# EAGLE board PCB_KioskMB_r3.4-01 (EAGLE 8.2.2), part 1 of 3
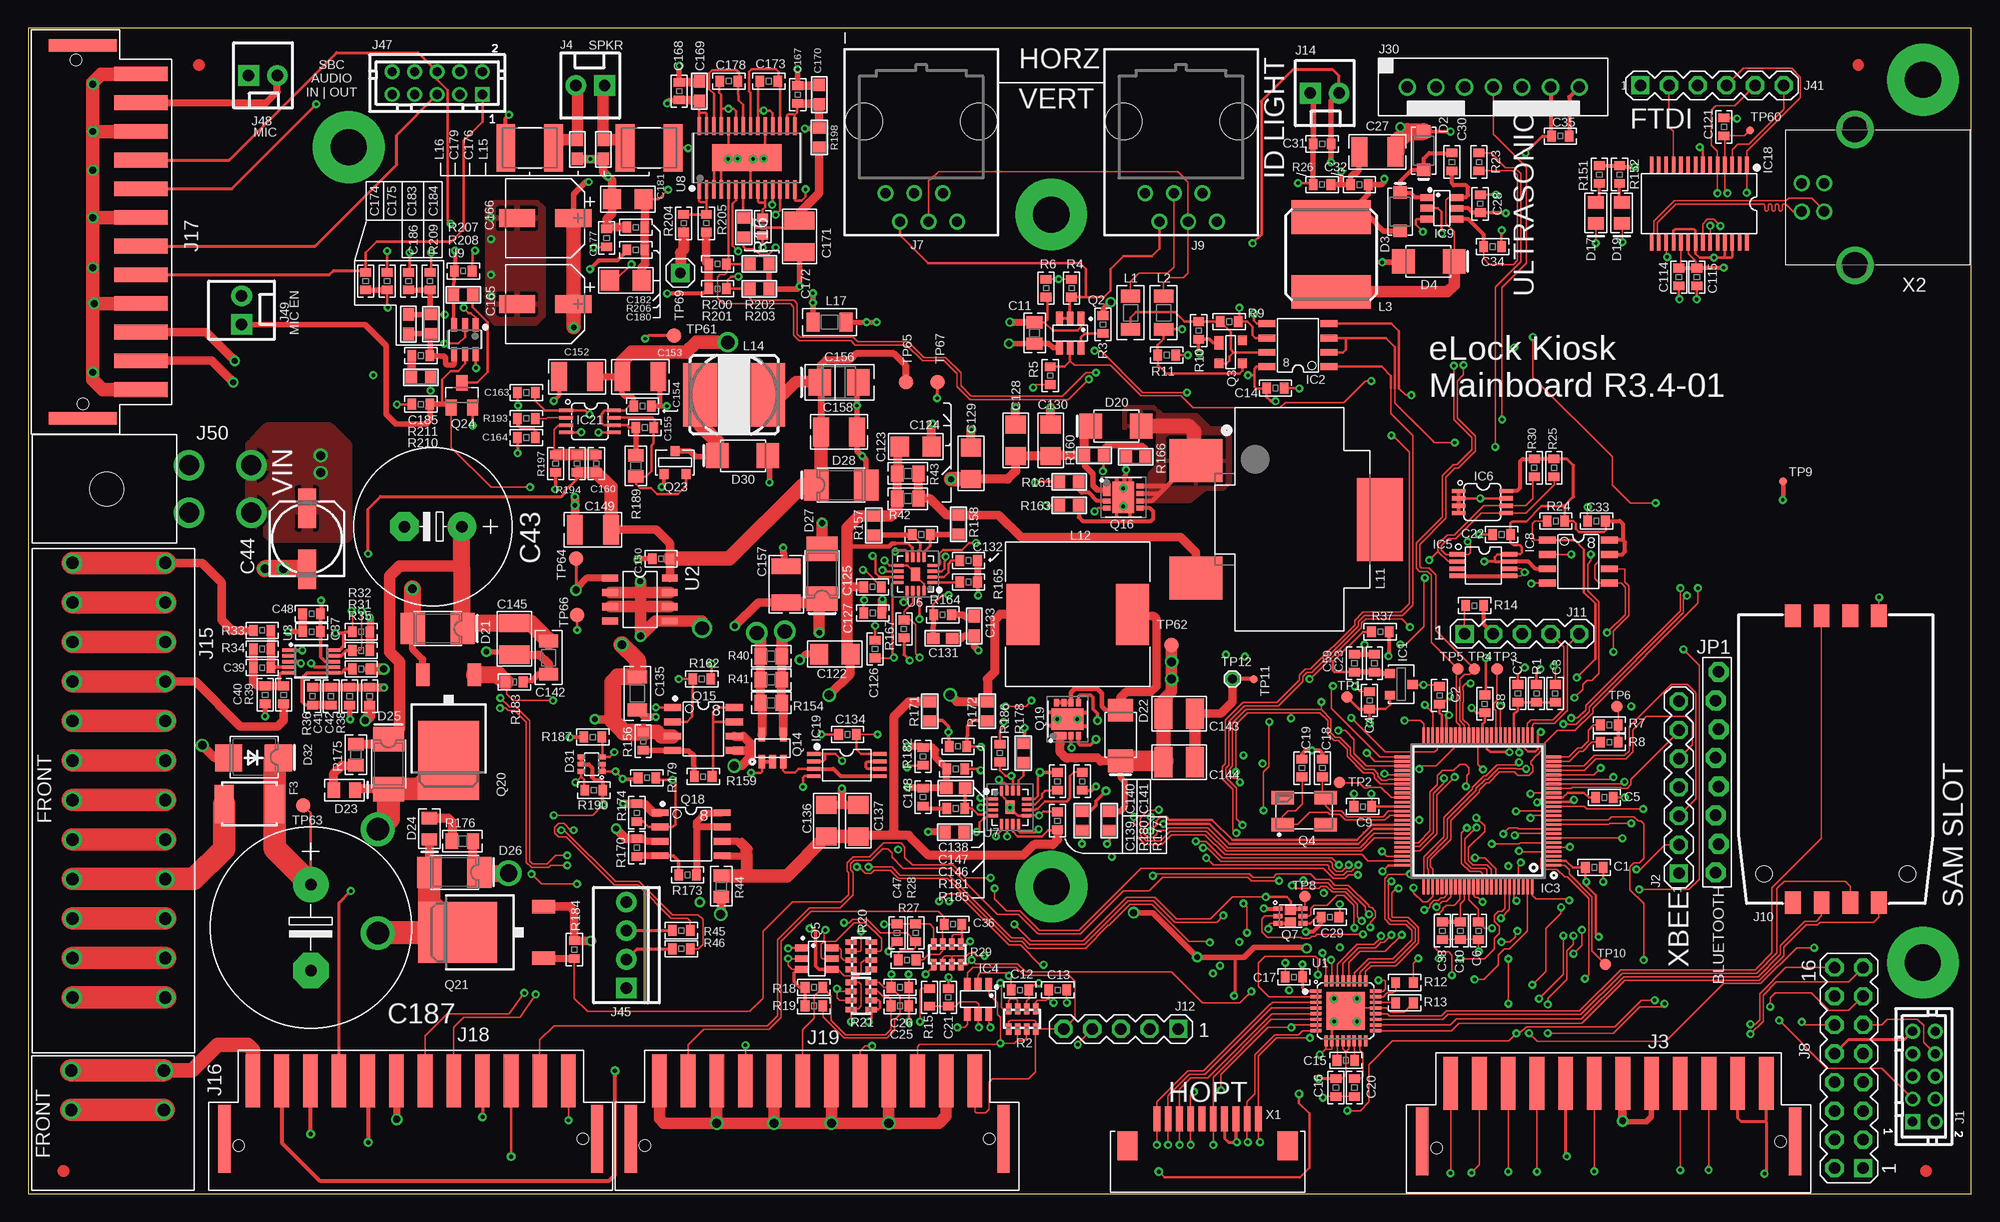
[diagram p11: board, top side]
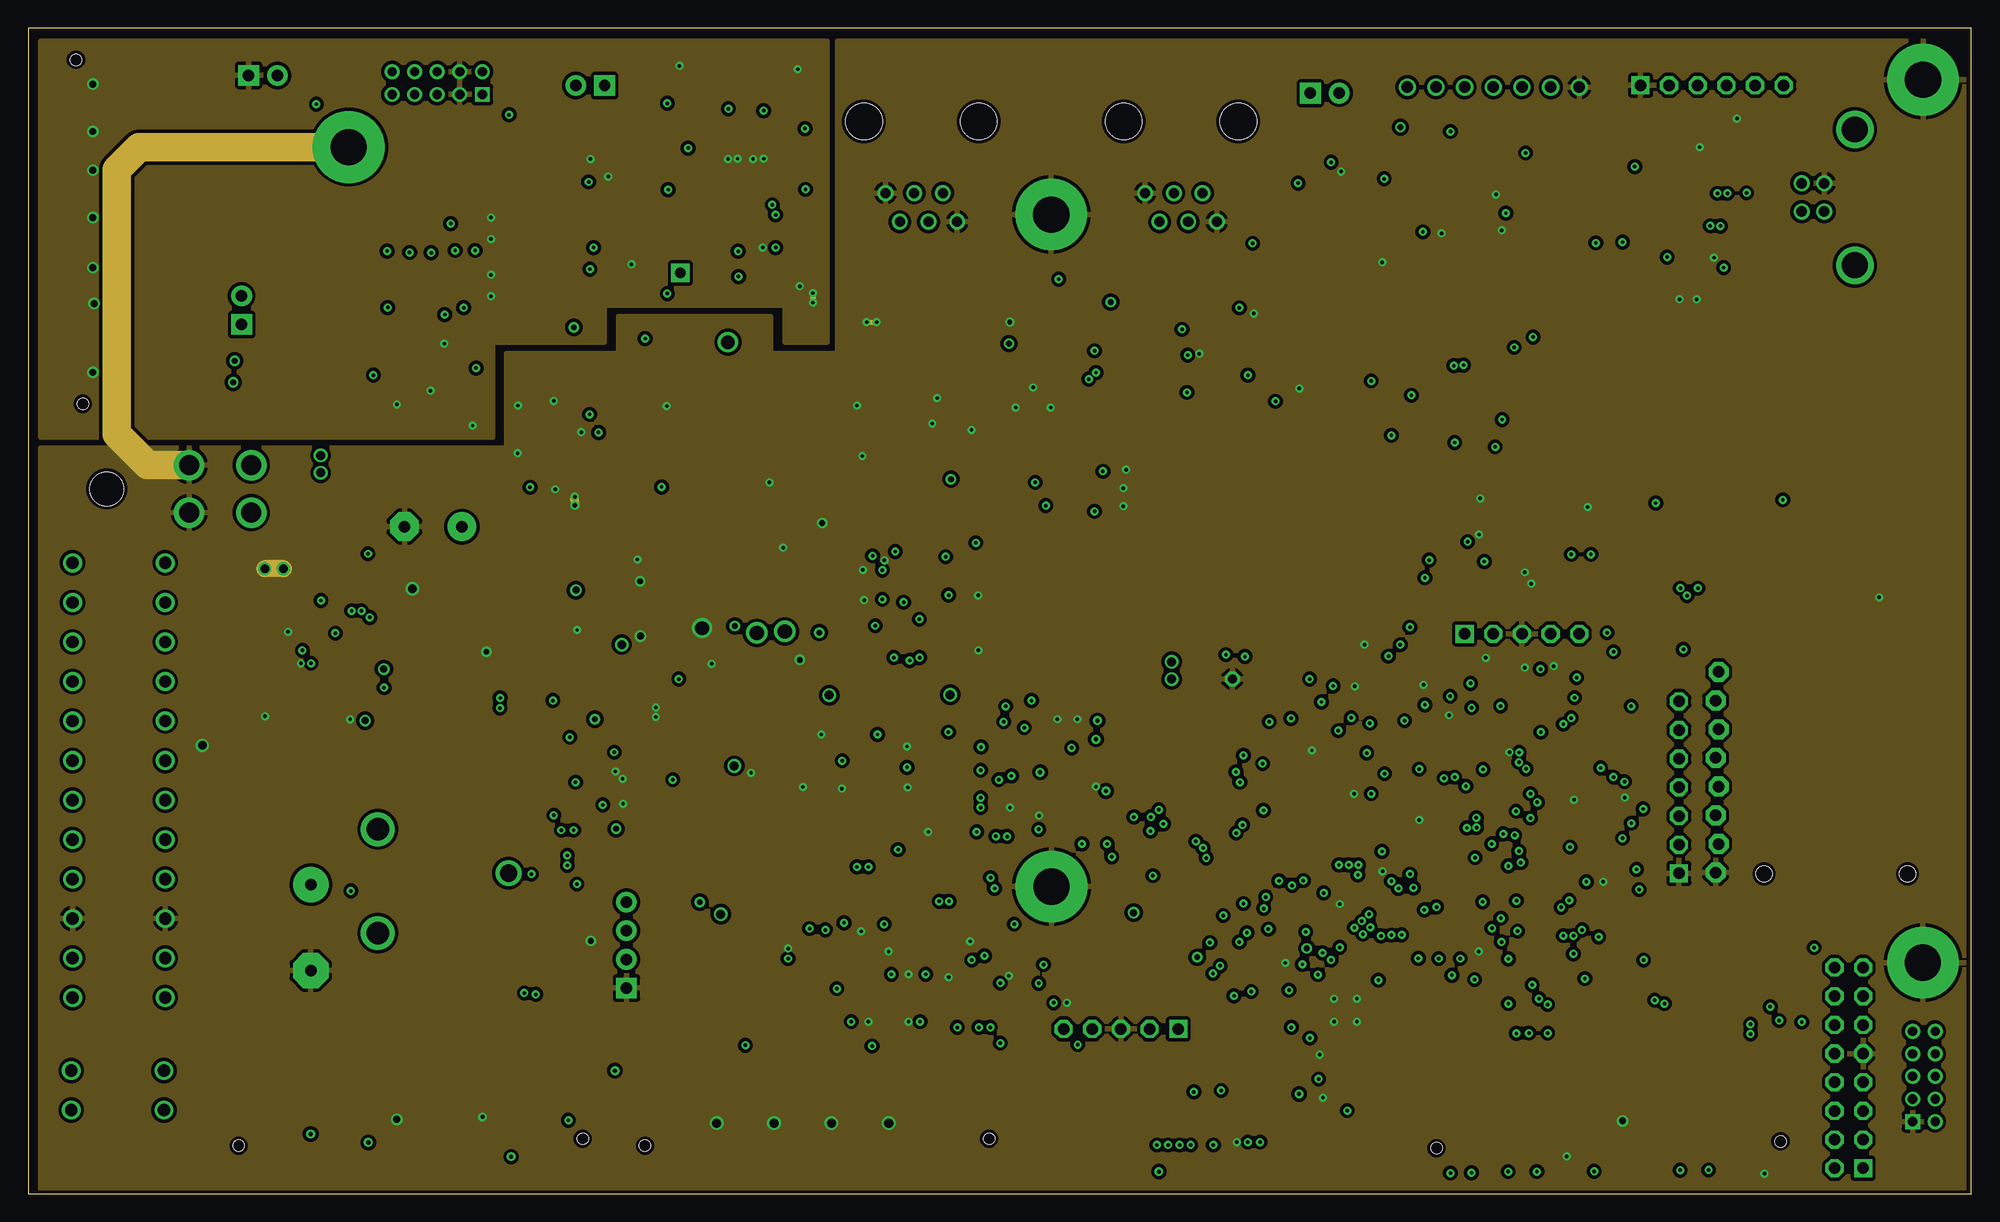
[diagram p12: board, inner layer DGND]
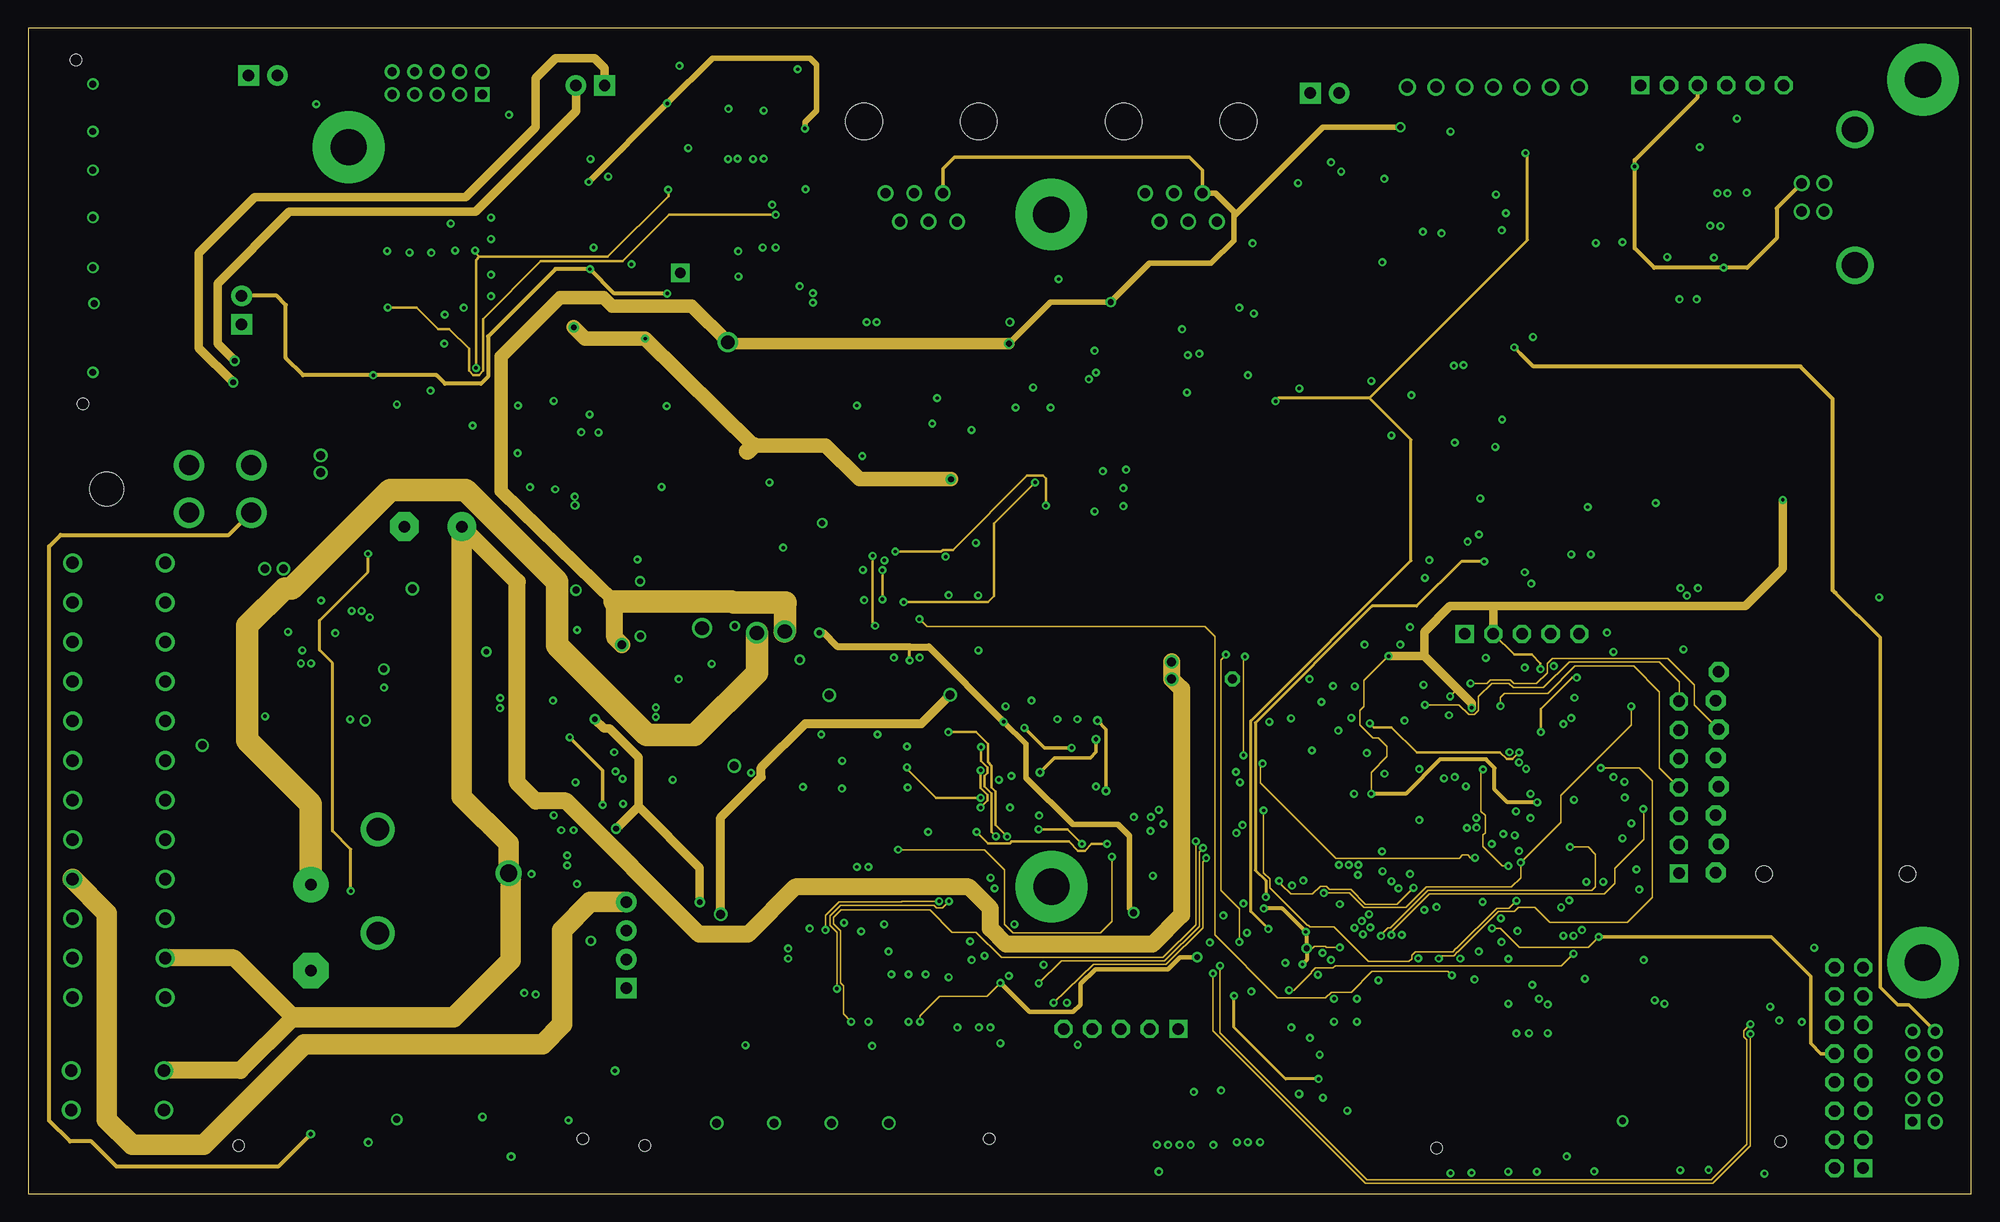
[diagram p13: board, inner layer SUPPLY]
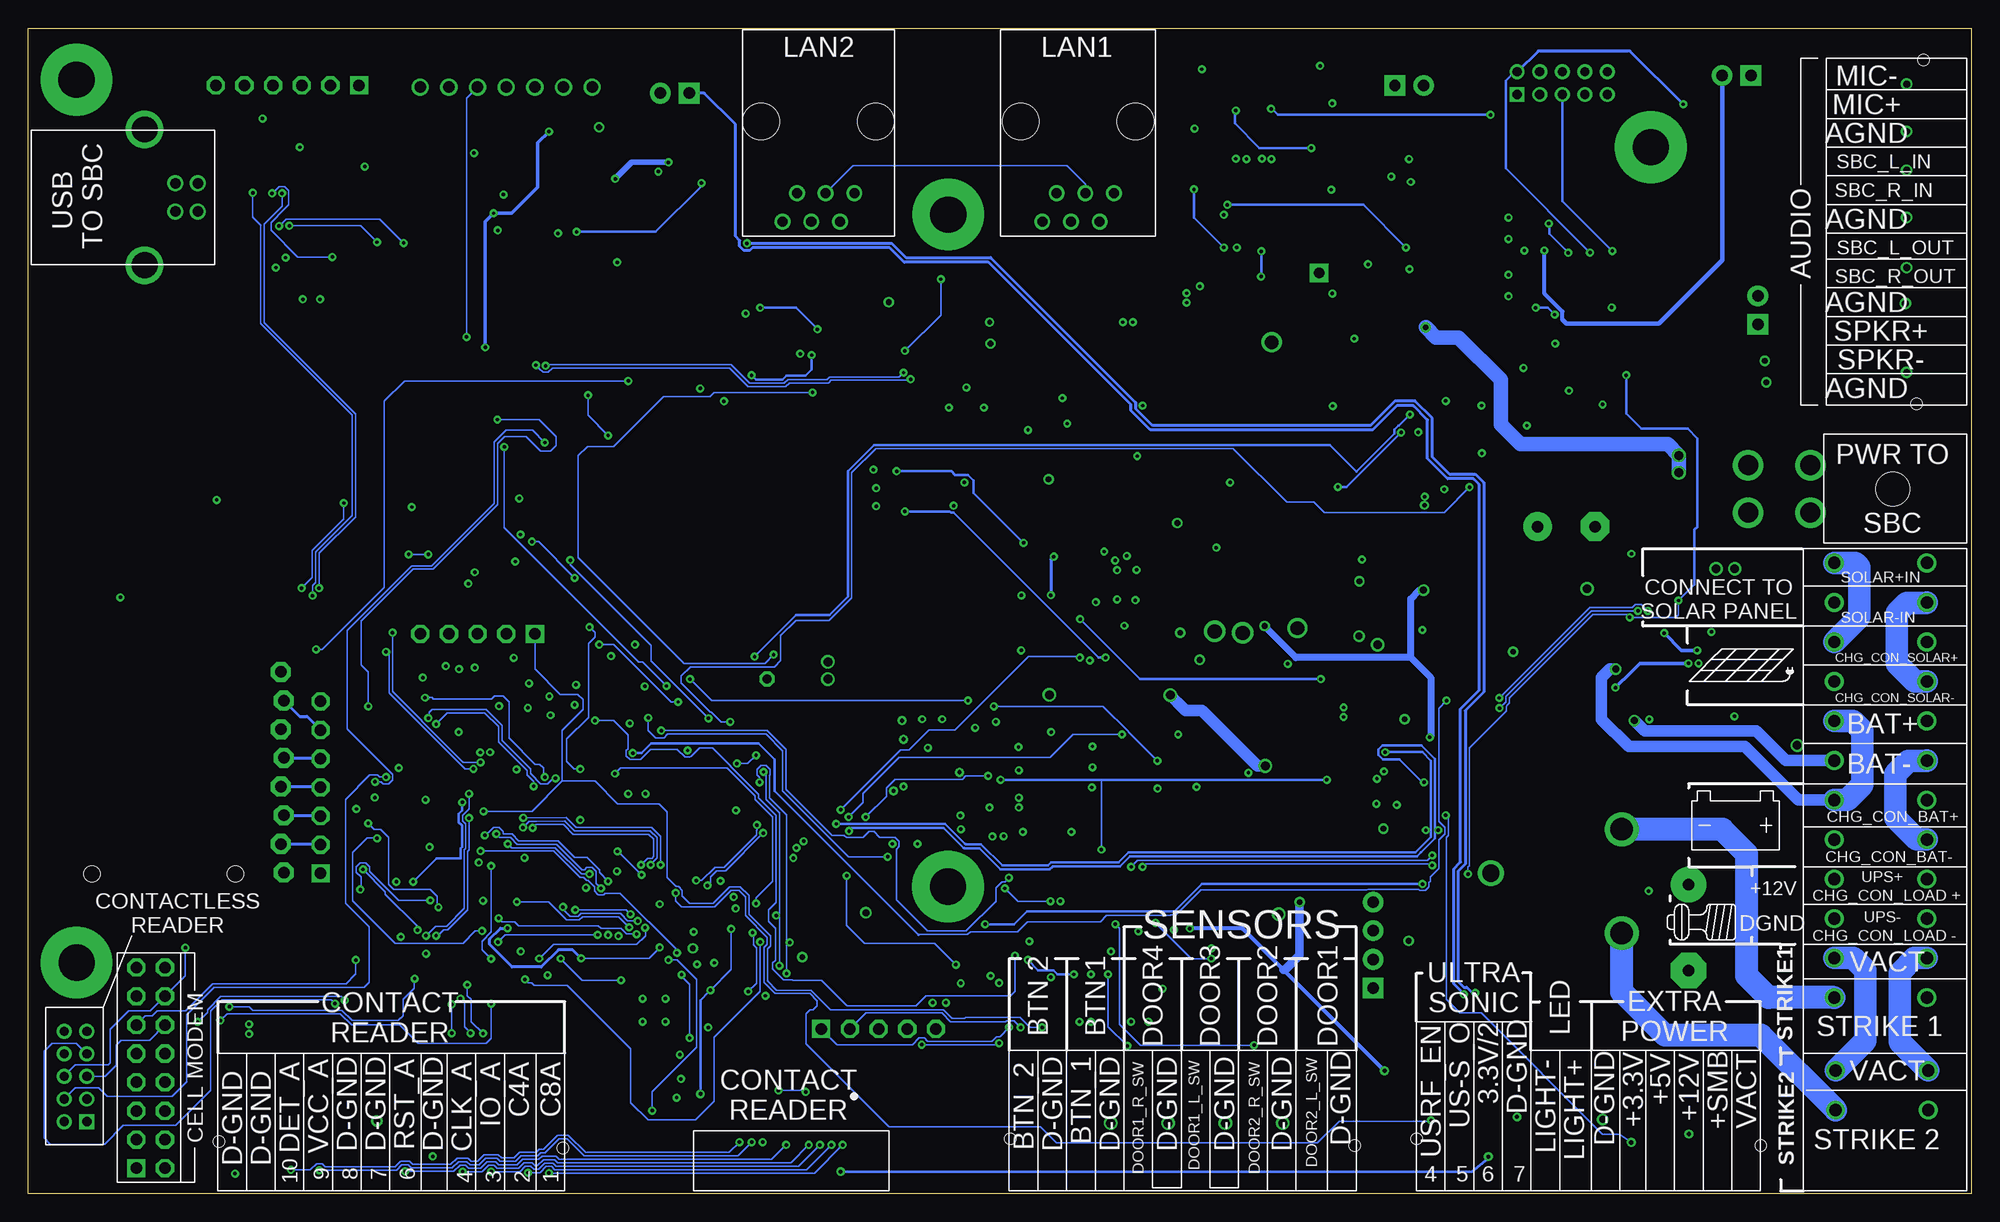
[diagram p14: board, bottom side, seen from below]

Size 172.11 x 103.25 mm. Coordinates in mm from the lower left corner, seen from the top.
Outline: 172.11,103.25 0,103.25 0,0 172.11,0 172.11,103.25
Copper layers (1*2*15*16): Top 0.035mm / dielectric 0.33mm / DGND 0.035mm / dielectric 0.8mm / SUPPLY 0.035mm / dielectric 0.33mm / Bottom 0.035mm
Design rules "alleybeachdrc4layer *": minimum track width 6mil, minimum drill 0.3mm, track to track 6mil, track to pad 6mil, pad to pad 6mil, via to via 6mil, smd to smd 6mil, copper to edge 10mil, drill to drill 10mil, minimum pad ring 10mil, minimum via ring 8mil, stop-mask expansion 4mil, vias tented up to drill 0.3mm, thermal gap 12mil

## Footprints (pad centres in the part's own frame; a part is rotated, then mirrored left to right if it is on the bottom)
0603 = smd 0.762 x 0.965: 1 -0.787,0; 2 0.787,0
0805 = smd 1.092 x 1.397: 1 -0.94,0; 2 0.94,0
1210 = smd 1.397 x 2.591: 1 -1.6,0; 2 1.6,0
E5-13 = drill 1.016 pad 2.54: + -2.54,0 | drill 1.016 pad 2.54 octagon: - 2.54,0
153CLV-0605 = smd 3.5 x 1.6: + 2.7,0; - -2.7,0
C1206 = smd 1.6 x 1.8: 1 -1.4,0; 2 1.4,0
C0603 = smd 1.1 x 1: 1 -0.85,0; 2 0.85,0
1206 = smd 1.143 x 1.702: 1 -1.473,0; 2 1.473,0
C1210 = smd 1.6 x 2.7: 1 -1.4,0; 2 1.4,0
3528-POL = smd 2.007 x 2.388: 1 -1.702,0; 2 1.702,0
CAP_6.3MM_DIA_SMT = smd 1.6 x 3.2: 1 0,2.5; 2 0,-2.5
E7,5-18 = drill 1.016 pad 3.15: + -3.81,0 | drill 1.016 pad 3.15 octagon: - 3.81,0
SOD-123 = smd 1.1 x 1.2: A 1.7,0; C -1.7,0
SOD-128 = smd 2 x 2.2: A 2.2,0; K -2.3,0
0805-POL = smd 1.092 x 1.397: 1+ -0.94,0; 2 0.94,0
SMA = smd 2.159 x 2.743: + -2.311,0.003; - 2.108,-0.002
SMA' = smd 2.159 x 2.743: A 2.108,-0.002; C -2.311,0.003
SOT-363 = smd 0.42 x 0.6: 1 -0.65,-0.95; 2 0,-0.95; 3 0.65,-0.95; 4 0.65,0.95; 5 0,0.95; 6 -0.65,0.95
SMB = smd 2.4 x 2.4: A 2.2,0; C -2.2,0
1812 = smd 1.702 x 3.4: 1 -2.235,0; 2 2.235,0
STANDOFF-ELECTRICAL = drill 3.2 pad 6.35: P1 0,0
SOT-23 = smd 0.787 x 0.889: 1 0.991,1.016; 2 -0.94,1.016; 3 0.025,-1.016
SO08 = smd 0.61 x 1.524: 1 -1.905,-2.743; 2 -0.635,-2.743; 3 0.635,-2.743; 4 1.905,-2.743; 5 1.905,2.743; 6 0.635,2.743; 7 -0.635,2.743; 8 -1.905,2.743
SQFP-S-12X12-100 = smd 0.24 x 1.6: 1 -4.8,-6.6; 2 -4.4,-6.6; 3 -4,-6.6; 4 -3.6,-6.6; 5 -3.2,-6.6; 6 -2.8,-6.6; 7 -2.4,-6.6; 8 -2,-6.6; 9 -1.6,-6.6; 10 -1.2,-6.6; 11 -0.8,-6.6; 12 -0.4,-6.6; 13 0,-6.6; 14 0.4,-6.6; 15 0.8,-6.6; 16 1.2,-6.6; 17 1.6,-6.6; 18 2,-6.6; 19 2.4,-6.6; 20 2.8,-6.6; 21 3.2,-6.6; 22 3.6,-6.6; 23 4,-6.6; 24 4.4,-6.6; 25 4.8,-6.6; 51 4.8,6.6; 52 4.4,6.6; 53 4,6.6; 54 3.6,6.6; 55 3.2,6.6; 56 2.8,6.6; 57 2.4,6.6; 58 2,6.6; 59 1.6,6.6; 60 1.2,6.6; 61 0.8,6.6; 62 0.4,6.6; 63 0,6.6; 64 -0.4,6.6; 65 -0.8,6.6; 66 -1.2,6.6; 67 -1.6,6.6; 68 -2,6.6; 69 -2.4,6.6; 70 -2.8,6.6; 71 -3.2,6.6; 72 -3.6,6.6; 73 -4,6.6; 74 -4.4,6.6; 75 -4.8,6.6 | smd 1.6 x 0.24: 26 6.6,-4.8; 27 6.6,-4.4; 28 6.6,-4; 29 6.6,-3.6; 30 6.6,-3.2; 31 6.6,-2.8; 32 6.6,-2.4; 33 6.6,-2; 34 6.6,-1.6; 35 6.6,-1.2; 36 6.6,-0.8; 37 6.6,-0.4; 38 6.6,0; 39 6.6,0.4; 40 6.6,0.8; 41 6.6,1.2; 42 6.6,1.6; 43 6.6,2; 44 6.6,2.4; 45 6.6,2.8; 46 6.6,3.2; 47 6.6,3.6; 48 6.6,4; 49 6.6,4.4; 50 6.6,4.8; 76 -6.6,4.8; 77 -6.6,4.4; 78 -6.6,4; 79 -6.6,3.6; 80 -6.6,3.2; 81 -6.6,2.8; 82 -6.6,2.4; 83 -6.6,2; 84 -6.6,1.6; 85 -6.6,1.2; 86 -6.6,0.8; 87 -6.6,0.4; 88 -6.6,0; 89 -6.6,-0.4; 90 -6.6,-0.8; 91 -6.6,-1.2; 92 -6.6,-1.6; 93 -6.6,-2; 94 -6.6,-2.4; 95 -6.6,-2.8; 96 -6.6,-3.2; 97 -6.6,-3.6; 98 -6.6,-4; 99 -6.6,-4.4; 100 -6.6,-4.8
SOT23-6 = smd 0.6 x 1.2: 1 -0.95,-1.306; 2 0,-1.306; 3 0.95,-1.306; 4 0.95,1.306; 5 0.003,1.306; 6 -0.95,1.306
TSSOP08-3 = smd 0.38 x 1.4: 1 -0.94,-2.343; 2 -0.305,-2.343; 3 0.33,-2.343; 4 0.965,-2.343; 5 0.965,2.292; 6 0.33,2.292; 7 -0.305,2.292; 8 -0.94,2.292
MSOP-08 = smd 0.38 x 1.2: 1 -1.008,-2.18; 2 -0.358,-2.18; 3 0.292,-2.18; 4 0.942,-2.18; 5 0.942,2.045; 6 0.292,2.045; 7 -0.358,2.045; 8 -1.008,2.045
SO-08 = smd 0.61 x 1.524: 1 -1.905,-2.743; 2 -0.635,-2.743; 3 0.635,-2.743; 4 1.905,-2.743; 5 1.905,2.743; 6 0.635,2.743; 7 -0.635,2.743; 8 -1.905,2.743
SSOP28DB = smd 0.32 x 1.4: 1 -4.225,-3.45; 2 -3.575,-3.45; 3 -2.925,-3.45; 4 -2.275,-3.45; 5 -1.625,-3.45; 6 -0.975,-3.45; 7 -0.325,-3.45; 8 0.325,-3.45; 9 0.975,-3.45; 10 1.625,-3.45; 11 2.275,-3.45; 12 2.925,-3.45; 13 3.575,-3.45; 14 4.225,-3.45; 15 4.225,3.45; 16 3.575,3.45; 17 2.925,3.45; 18 2.275,3.45; 19 1.625,3.45; 20 0.975,3.45; 21 0.325,3.45; 22 -0.325,3.45; 23 -0.975,3.45; 24 -1.625,3.45; 25 -2.275,3.45; 26 -2.925,3.45; 27 -3.575,3.45; 28 -4.225,3.45
TSSOP8 = smd 0.35 x 1.2: 1 -0.975,-2.925; 2 -0.325,-2.925; 3 0.325,-2.925; 4 0.975,-2.925; 5 0.975,2.925; 6 0.325,2.925; 7 -0.325,2.925; 8 -0.975,2.925
MSOP-08' = smd 0.3 x 1.2: 1 -1.008,-2.18; 2 -0.358,-2.18; 3 0.292,-2.18; 4 0.942,-2.18; 5 0.942,2.045; 6 0.292,2.045; 7 -0.358,2.045; 8 -1.008,2.045
DF11-10DP-2DSA = drill 0.813 pad 1.321 square: 1 4,-1 | drill 0.813 pad 1.321: 2 4,1; 3 2,-1; 4 2,1; 5 0,-1; 6 0,1; 7 -2,-1; 8 -2,1; 9 -4,-1; 10 -4,1
MA07-1 = drill 1.016 pad 1.6 square: 1 -7.62,0 | drill 1.016 pad 1.6 octagon: 2 -5.08,0; 3 -2.54,0; 4 0,0; 5 2.54,0; 6 5.08,0; 7 7.62,0
14011213102000 = smd 1.3 x 4.7: 1 13.97,-4.4; 2 11.43,-4.4; 3 8.89,-4.4; 4 6.35,-4.4; 5 3.81,-4.4; 6 1.27,-4.4; 7 -1.27,-4.4; 8 -3.81,-4.4; 9 -6.35,-4.4; 10 -8.89,-4.4; 11 -11.43,-4.4; 12 -13.97,-4.4 | smd 1.1 x 6: P$1 16.51,0.75; P$2 -16.51,0.75 | hole 1: -15.24,0.75; 15.24,1.35
3-641215-2 = drill 1.016 pad 1.829 square: 1 2.54,0 | drill 1.016 pad 1.829: 2 0,0
SS-6566-NF = drill 0.889: 1 -3.175,8.89; 2 -1.905,6.35; 3 -0.635,8.89; 4 0.635,6.35; 5 1.905,8.89; 6 3.175,6.35 | hole 3.251: 5.08,0; -5.08,0
MA08-2 = drill 1.016 pad 1.6 square: 1 -8.89,-1.27 | drill 1.016 pad 1.6 octagon: 2 -8.89,1.27; 3 -6.35,-1.27; 4 -6.35,1.27; 5 -3.81,-1.27; 6 -3.81,1.27; 7 -1.27,-1.27; 8 -1.27,1.27; 9 1.27,-1.27; 10 1.27,1.27; 11 3.81,-1.27; 12 3.81,1.27; 13 6.35,-1.27; 14 6.35,1.27; 15 8.89,-1.27; 16 8.89,1.27
CCM03-3504LFT-NR = smd 2 x 1.4: C1 12.7,3.81; C2 12.7,1.27; C3 12.7,-1.27; C4 12.7,-3.81; C5 -12.7,3.81; C6 -12.7,1.27; C7 -12.7,-1.27; C8 -12.7,-3.81 | hole 1.422: 10.16,6.35; 10.16,-6.35
MA05-1 = drill 1.016 pad 1.6 square: 1 -5.08,0 | drill 1.016 pad 1.6 octagon: 2 -2.54,0; 3 0,0; 4 2.54,0; 5 5.08,0
1990834 = drill 1.1: 1 0,0; 1A 0,8.2; 2 3.5,0; 2A 3.5,8.2; 3 7,0; 3A 7,8.2; 4 10.5,0; 4A 10.5,8.2; 5 14,0; 5A 14,8.2; 6 17.5,0; 6A 17.5,8.2; 7 21,0; 7A 21,8.2; 8 24.5,0; 8A 24.5,8.2; 9 28,0; 9A 28,8.2; 10 31.5,0; 10A 31.5,8.2; 11 35,0; 11A 35,8.2; 12 38.5,0; 12A 38.5,8.2
1990737 = drill 1.1: 1 0,0; 1A 0,8.2; 2 3.5,0; 2A 3.5,8.2
HRXL-MAXSONAR-WRC-MB7387 = drill 1.016: 1 2.54,2.54; 2 5.08,2.54; 3 7.62,2.54; 4 10.16,2.54; 5 12.7,2.54; 6 15.24,2.54; 7 17.78,2.54
MA06-1 = drill 1.016 pad 1.6 square: 1 -6.35,0 | drill 1.016 pad 1.6 octagon: 2 -3.81,0; 3 -1.27,0; 4 1.27,0; 5 3.81,0; 6 6.35,0
3-641215-4 = drill 1.016 pad 1.829 square: 1 3.81,0 | drill 1.016 pad 1.829: 2 1.27,0; 3 -1.27,0; 4 -3.81,0
0039301040 = drill 1.8: 1 -2.1,0; 2 2.1,0; 3 -2.1,5.5; 4 2.1,5.5 | hole 3: 0,-7.3
1X08-LOCK = drill 1.016 pad 1.778 octagon: 1 -8.89,0.127; 2 -6.35,-0.127; 3 -3.81,0.127; 4 -1.27,-0.127; 5 1.27,0.127; 6 3.81,-0.127; 7 6.35,0.127; 8 8.89,-0.127
NRS8030 = smd 7 x 3: 1 0,-3.3; 2 0,3.3
L_SER20XX = smd 3.81 x 4.699: 1 -5.207,-8.319; 2 5.207,-8.319 | smd 7.366 x 4.064: 3 0,8.001
L_SRR1280 = smd 5.4 x 2.9: 1 0,4.85; 2 0,-4.85
CR75 = smd 5.6 x 3: 1 0,-3; 2 0,3
L1812 = smd 1.66 x 4.22: 1 -2.12,0; 2 2.12,0
SSOT-6 = smd 0.6 x 1.2: 1 -0.95,-1.306; 2 0,-1.306; 3 0.95,-1.306; 4 0.95,1.306; 5 0.003,1.306; 6 -0.95,1.306
SOT-143 = smd 1.194 x 0.838: 1 -0.813,-1.041 | smd 0.838 x 0.838: 2 0.991,-1.041; 3 0.991,1.041; 4 -1.016,1.041
7B = smd 2 x 1.2: 1 -1.9,-1.2; 2 1.9,-1.2; 3 1.9,1.2; 4 -1.9,1.2
MICRO_FET = smd 0.42 x 0.8: 1 -0.65,-1.1; 2 0,-1.1; 3 0.65,-1.1; 4 0.65,1.1; 5 0,1.1; 6 -0.65,1.1 | smd 0.8 x 1: P1 -0.5,0; P2 0.5,0
SOT23-5 = smd 0.6 x 1.2: 1 -0.95,-1.206; 2 0,-1.206; 3 0.95,-1.206; 4 0.95,1.206; 5 -0.95,1.206
SON8_3.3X3.3_TI = smd 1.09 x 0.65: 1_2 -0.65,-1.475 | smd 0.44 x 0.65: 3 0.325,-1.475; 4 0.975,-1.475; 5 0.975,1.475; 6 0.325,1.475; 7 -0.325,1.475; 8 -0.975,1.475 | smd 2.8 x 1.9: EP 0,0
TO252 = smd 1.2 x 2: 1 -2.28,-4.8; 2 2.28,-4.8 | smd 5.4 x 7: 3 0,2.8
SOT23 = smd 1 x 1.4: 1 -0.95,-1.1; 2 0.95,-1.1; 3 0,1.1
0603-ARRAY = smd 0.5 x 1: 1 -1.2,-0.9; 2 -0.4,-0.9; 3 0.4,-0.9; 4 1.2,-0.9; 5 1.2,0.9; 6 0.4,0.9; 7 -0.4,0.9; 8 -1.2,0.9
0603-0RTOP = smd 0.762 x 0.965: 1 -0.787,0; 2 0.787,0
R0603 = smd 1 x 1.1: 1 -0.85,0; 2 0.85,0
SMD_ROUND_1MM = smd 1 x 1: P$1 0,0
SMD_ROUND_07MM = smd 0.7 x 0.7: P$1 0,0
TP_0.8_1.2 = drill 0.813 pad 1.219 octagon: 1 0,0
B1,27 = smd 1.27 x 1.27: TP 0,0
P1-13@1 = drill 0.914 pad 1.626 square: 1 0,0
LFCSP_5X5_032 = smd 1 x 0.3: 1 -2.65,1.75; 2 -2.65,1.25; 3 -2.65,0.75; 4 -2.65,0.25; 5 -2.65,-0.25; 6 -2.65,-0.75; 7 -2.65,-1.25; 8 -2.65,-1.75; 17 2.65,-1.75; 18 2.65,-1.25; 19 2.65,-0.75; 20 2.65,-0.25; 21 2.65,0.25; 22 2.65,0.75; 23 2.65,1.25; 24 2.65,1.75 | smd 0.3 x 1: 9 -1.75,-2.65; 10 -1.25,-2.65; 11 -0.75,-2.65; 12 -0.25,-2.65; 13 0.25,-2.65; 14 0.75,-2.65; 15 1.25,-2.65; 16 1.75,-2.65; 25 1.75,2.65; 26 1.25,2.65; 27 0.75,2.65; 28 0.25,2.65; 29 -0.25,2.65; 30 -0.75,2.65; 31 -1.25,2.65; 32 -1.75,2.65 | smd 3.4 x 3.4: PAD 0,0
LE33 = smd 0.635 x 1.4: 1 -1.905,-2.65; 2 -0.635,-2.65; 3 0.635,-2.65; 4 1.905,-2.65; 5 1.905,2.65; 6 0.635,2.65; 7 -0.635,2.65; 8 -1.905,2.65
MSOP10 = smd 0.3 x 1: 1 -1,-2.05; 2 -0.5,-2.05; 3 0,-2.05; 4 0.5,-2.05; 5 1,-2.05; 6 1,2.05; 7 0.5,2.05; 8 0,2.05; 9 -0.5,2.05; 10 -1,2.05
QFN16_3X3_EP = smd 0.85 x 0.28: 1 -1.475,0.75; 2 -1.475,0.25; 3 -1.475,-0.25; 4 -1.475,-0.75; 9 1.475,-0.75; 10 1.475,-0.25; 11 1.475,0.25; 12 1.475,0.75 | smd 0.28 x 0.85: 5 -0.75,-1.475; 6 -0.25,-1.475; 7 0.25,-1.475; 8 0.75,-1.475; 13 0.75,1.475; 14 0.25,1.475; 15 -0.25,1.475; 16 -0.75,1.475 | smd 0.8 x 1.2: EP 0,0
TSSOP28_EP = smd 1.6 x 0.3: 1 -2.8,4.225; 2 -2.8,3.575; 3 -2.8,2.925; 4 -2.8,2.275; 5 -2.8,1.625; 6 -2.8,0.975; 7 -2.8,0.325; 8 -2.8,-0.325; 9 -2.8,-0.975; 10 -2.8,-1.625; 11 -2.8,-2.275; 12 -2.8,-2.925; 13 -2.8,-3.575; 14 -2.8,-4.225; 15 2.8,-4.225; 16 2.8,-3.575; 17 2.8,-2.925; 18 2.8,-2.275; 19 2.8,-1.625; 20 2.8,-0.975; 21 2.8,-0.325; 22 2.8,0.325; 23 2.8,0.975; 24 2.8,1.625; 25 2.8,2.275; 26 2.8,2.925; 27 2.8,3.575; 28 2.8,4.225 | smd 2.4 x 6.17: EP 0,0
SOT23-6' = smd 0.55 x 1.2: 1 -0.95,-1.3; 2 0,-1.3; 3 0.95,-1.3; 4 0.95,1.3; 5 0,1.3; 6 -0.95,1.3
CON-FPC-1.0MM-10POS = smd 0.6 x 2.2: 1 -4.5,0; 2 -3.5,0; 3 -2.5,0; 4 -1.5,0; 5 -0.5,0; 6 0.5,0; 7 1.5,0; 8 2.5,0; 9 3.5,0; 10 4.5,0 | smd 1.8 x 2.6: P$1 -7.1,-2.4; P$2 7.1,-2.4
85-32004-10X = drill 0.92 pad 1.27: 1 4.71,-1.25; 2 4.71,1.25; 3 2.71,1.25; 4 2.71,-1.25 | drill 2.3 pad 3: M1 0,6.02; M2 0,-6.02

## Placement (x,y rotation side)
C1  1u/10V  [0603]  138.71,28.9 0 top
C2  0.1uF  [0603]  125.01,44.15 90 top
C3  10uF/4V  [0603]  135.25,44.32 90 top
C4  0.1uF  [0603]  118.81,43.7 90 top
C5  0.1uF  [0603]  139.61,35.1 0 top
C6  0.1uF  [0603]  128.47,23.3 270 top
C7  10uF/4V  [0603]  131.95,44.32 90 top
C8  1u/10V  [0603]  129.01,43.4 90 top
C9  10uF/4V  [0603]  118.21,34.3 180 top
C10  10uF/4V  [0603]  126.87,23.3 90 top
C11  4.7uF/16V  [0805]  89.14,76.25 90 top
C12  10nF  [0603]  87.85,18.05 180 top
C13  10nF  [0603]  91.19,18.05 0 top
C14  1u/6.3V  [0603]  110.48,71.37 0 top
C15  1u/10V  [0603]  116.71,11.81 0 top
C16  4.7uF/6.3V  [0603]  115.82,9.4 90 top
C17  0.1uF  [0603]  112.11,19.2 180 top
C18  18pF  [0603]  114.63,37.71 270 top
C19  18pF  [0603]  112.83,37.71 270 top
C20  4.7uF/6.3V  [0603]  117.47,9.4 90 top
C21  0.1uF  [0603]  81.5,17.4 90 top
C22  0.1uF  [0603]  130.51,58.4 180 top
C23  10uF/4V  [0603]  119.25,46.99 90 top
C25  10nF  [0603]  77.22,16.64 0 top
C26  10nF  [0603]  77.22,18.29 0 top
C27  22u/16V  [1210]  119.51,92.3 180 top
C28  1uF/16V  [0603]  128.61,87.7 90 top
C29  10uF/4V  [0603]  115.31,24.5 180 top
C30  0.1uF  [0603]  126.11,91.4 270 top
C31  1uF/16V  [0603]  114.61,93 180 top
C32  1uF/16V  [0603]  117.91,89.4 180 top
C33  0.1uF  [0603]  138.91,59.6 180 top
C34  dnp  [0603]  129.71,83.9 0 top
C35  0.1uF  [0603]  135.71,93.7 180 top
C36  10nF  [0603]  81.92,23.88 0 top
C37  0.1uF  [0603]  25.11,49.8 180 top
C38  10uF/4V  [0603]  125.27,23.3 90 top
C39  10uF/4V  [0603]  20.73,46.61 180 top
C40  0.1uF  [0603]  20.98,44.2 270 top
C41  10uF/4V  [0603]  26.82,44.07 90 top
C42  0.1uF  [0603]  28.47,44.07 270 top
C43  470uF/35-50V  [E5-13]  35.86,59.1 180 top
C44  220uF, 16V, AL  [153CLV-0605]  24.69,58.02 90 top
C47  10nF  [0603]  76.96,23.11 270 top
C48  10uF/4V  [0603]  25.1,51.38 180 top
C59  10uF/4V  [0603]  117.47,46.99 90 top
C114  0.1uF  [0603]  146.21,81.21 90 top
C115  4.7uF/6.3V  [0603]  147.81,81.21 90 top
C121  0.1uF  [0603]  150.21,94.51 270 top
C122  22uF,25V,1206  [C1206]  71.44,47.81 180 top
C123  22uF,25V,1206  [C1206]  78.6,66.19 0 top
C124  100pF  [0603]  79.1,58.39 0 top
C125  0.1uF  [0603]  74.79,53.76 0 top
C126  0.1uF  [0603]  75.02,48.25 270 top
C127  4.7uF/6.3V  [0603]  74.81,51.45 180 top
C128  22uF,25V,1206  [C1206]  87.47,66.73 90 top
C129  22uF,25V,1206  [C1206]  83.5,64.7 90 top
C130  22uF,25V,1206  [C1206]  90.57,66.73 90 top
C131  130pF,C0G  [C0603]  81,49.19 0 top
C132  0.1uF  [0603]  83.3,56.09 0 top
C133  15nF  [C0603]  83.8,50.29 270 top
C134  10nF  [0603]  72.56,40.69 180 top
C135  10uF/35V  [1206]  53.96,44.32 270 top
C136  22uF,25V,1206  [C1206]  70.69,33.06 90 top
C137  22uF,25V,1206  [C1206]  73.53,33.03 90 top
C138  100pF  [0603]  82.36,39.64 0 top
C139  0.1uF  [0603]  91.16,33.04 90 top
C140  0.1uF  [0603]  91.16,36.54 90 top
C141  4.7uF/6.3V  [0603]  93.36,36.54 270 top
C142  10uF/35V  [1206]  46.1,47.5 270 top
C143  10uF,50V,1210  [C1210]  101.96,42.54 0 top
C144  10uF,50V,1210  [C1210]  101.96,38.24 0 top
C145  10uF,50V,1210  [C1210]  43.05,49.15 270 top
C146  100pF  [C0603]  82.16,35.94 180 top
C147  0.1uF  [0603]  82.16,37.64 180 top
C148  10nF  [0603]  79.26,35.14 90 top
C149  22u/16V  [1210]  50.02,58.82 180 top
C150  0.1uF  [0603]  56.06,56.25 180 top
C152  22u/16V  [1210]  48.62,72.38 180 top
C153  22u/16V  [1210]  54.22,72.38 0 top
C154  0.1uF  [0603]  54.42,69.78 0 top
C155  1nF  [0603]  54.62,67.88 0 top
C156  TCJB157M006R0045  [3528-POL]  71.82,71.88 0 top
C157  47uF/6.3V  [1210]  67.13,53.98 90 top
C158  47uF/6.3V  [1210]  71.82,67.48 0 top
C160  15pF  [0603]  50.32,64.68 270 top
C163  0.1uF  [0603]  44.12,70.98 180 top
C164  330pF  [0603]  44.12,66.98 180 top
C165  220uF,16V,AL  [CAP_6.3MM_DIA_SMT]  45.79,78.82 270 top
C166  220uF,16V,AL  [CAP_6.3MM_DIA_SMT]  45.79,86.42 270 top
C167  0.1uF  [0603]  68.16,97.37 90 top
C168  0.1uF  [0603]  57.66,97.67 90 top
C169  1.0nF,50V  [C0603]  59.46,97.67 90 top
C170  1.0nF,50V  [C0603]  70.06,97.37 90 top
C171  10uF,50V,1210  [C1210]  68.32,84.8 270 top
C172  1uF,25V  [0603]  65.06,85.67 270 top
C173  0.47uF  [0603]  65.6,98.57 180 top
C174  0.47uF  [0603]  29.89,80.84 270 top
C175  0.47uF  [0603]  31.79,80.84 270 top
C176  1.0nF,50V  [C0603]  50.94,92.52 270 top
C177  0.47uF  [0603]  51.23,84.67 270 top
C178  0.47uF  [0603]  62.06,98.57 180 top
C179  1.0nF,50V  [C0603]  48.64,92.52 270 top
C180  22uF,25V,1206  [C1206]  52.92,80.92 180 top
C181  22uF,25V,1206  [C1206]  53.12,88.12 180 top
C182  1uF,25V  [0603]  53.82,85.62 180 top
C183  3.3uF,16V  [0603]  33.69,80.84 90 top
C184  3.3uF,16V  [0603]  35.59,80.84 90 top
C185  3.3uF,16V  [0603]  34.79,74.24 180 top
C186  220pF  [C0603]  33.69,77.04 90 top
C187  2mF/16V  [E7,5-18]  25.03,23.58 270 top
D2  DNP  [SOD-123]  123.61,92.4 90 top
D3  STPS0540Z  [SOD-123]  121.51,87 270 top
D4  PMEG3030BEP  [SOD-128]  124.01,82.6 180 top
D17  LED-GR  [0805-POL]  138.86,86.89 90 top
D19  LED-GR  [0805-POL]  141.16,86.89 90 top
D20  PMEG3030BEP  [SOD-128]  96.4,68.01 0 top
D21  SMAJ26A  [SMA]  36.17,50.06 180 top
D22  PMEG3030BEP  [SOD-128]  96.76,40.64 90 top
D23  LED-GR  [0805-POL]  28.02,35.76 180 top
D24  LED-GR  [0805-POL]  35.54,32.34 90 top
D25  SS14  [SMA']  31.91,37.95 270 top
D26  SS14  [SMA']  37.64,28.47 180 top
D27  SMLVT3V3  [SMA]  70.32,55.02 90 top
D28  SMAJ5.0A  [SMA]  72.12,62.78 0 top
D30  PMEG3030BEP  [SOD-128]  63.32,65.38 0 top
D31  BAT54BRW-7F  [SOT-363]  49.91,38.05 90 top
D32  P6SMB16A  [SMB]  19.97,38.62 180 top
DRILEGEND  [DRILEGEND]  208.46,100.99 0 top  (outside the outline)
F3  2920L250DR  [1812]  19.59,34.52 0 top
FID1  [REF]  3.11,2 0 top
FID2  [REF]  162.11,100 0 top
FID3  [REF]  15.11,100 0 top
FID4  [REF]  168.11,2 0 top
H1  STANDOFF_ELECTRICAL  [STANDOFF-ELECTRICAL]  28.39,92.72 0 top
H2  STANDOFF_ELECTRICAL  [STANDOFF-ELECTRICAL]  90.64,27.21 0 top
H3  STANDOFF_ELECTRICAL  [STANDOFF-ELECTRICAL]  167.83,20.47 0 top
H4  STANDOFF_ELECTRICAL  [STANDOFF-ELECTRICAL]  167.84,98.69 0 top
H5  STANDOFF_ELECTRICAL  [STANDOFF-ELECTRICAL]  90.61,86.75 0 top
IC1  ISL60002DIH325Z-TK  [SOT-23]  121.61,45.1 90 top
IC2  SN65HVD12D  [SO08]  112.48,75.17 90 top
IC3  PIC24FJ256GA110-I/PT  [SQFP-S-12X12-100]  128.41,33.9 90 top
IC4  PIC10F200T-I/OT  [SOT23-6]  84.14,17.24 180 top
IC5  LM75ADP  [TSSOP08-3]  128.91,55.7 270 top
IC6  24LC32A-I/MS  [MSOP-08]  128.87,61.24 270 top
IC8  M25P16-VMN6P  [SO-08]  137.31,56 270 top
IC9  LM3405AXMK/NOPB  [SOT23-6]  125.21,87.3 270 top
IC18  FT232RL  [SSOP28DB]  148.01,87.71 180 top
IC19  MCP602-I/ST  [TSSOP8]  72.5,37.97 270 top
IC21  LTC1771EMS8  [MSOP-08']  49.82,68.38 270 top
J1  DF11-10DP-2DSA(01)  [DF11-10DP-2DSA]  167.91,10.39 270 top
J2  DNP  [MA07-1]  146.21,36 90 top
J3  14011213102000  [14011213102000]  139.98,5.38 180 top
J4  3-641215-2  [3-641215-2]  48.51,98.17 0 top
J7  SS-6566-NF  [SS-6566-NF]  79.11,95 180 top
J8  TSW-108-07-G-D  [MA08-2]  161.27,11.15 90 top
J9  SS-6566-NF  [SS-6566-NF]  102.11,95 180 top
J10  CCM03-3504LFT-NR  [CCM03-3504LFT-NR]  160.11,38.5 270 top
J11  DNP  [MA05-1]  132.31,49.6 0 top
J12  DNP  [MA05-1]  96.79,14.59 180 top
J14  3-641215-2  [3-641215-2]  116.11,97.5 180 top
J15  1990834  [1990834]  3.94,55.88 270 top
J16  1990737  [1990737]  3.81,10.92 270 top
J17  14011213102000  [14011213102000]  5.59,85.22 90 top
J18  14011213102000  [14011213102000]  33.88,5.61 180 top
J19  14011213102000  [14011213102000]  69.88,5.61 180 top
J30  22-11-2072  [HRXL-MAXSONAR-WRC-MB7387]  119.61,95.5 0 top
J41  DNP  [MA06-1]  149.15,98.19 0 top
J45  3-641215-4  [3-641215-4]  52.99,22.03 270 top
J47  DF11-10DP-2DSA(01)  [DF11-10DP-2DSA]  36.23,98.39 0 top
J48  3-641215-2  [3-641215-2]  22.06,99.08 180 top
J49  3-641215-2  [3-641215-2]  18.9,79.54 270 top
J50  0039301040  [0039301040]  14.25,62.45 270 top
JP1  DNP  [1X08-LOCK]  149.61,37.34 90 top
L1  HI1206T500R-00  [1206]  97.65,78.05 90 top
L2  HI1206T500R-00  [1206]  100.57,78.05 90 top
L3  NRS8030T150MJGJ  [NRS8030]  115.41,83.2 0 top
L11  SER2013-472MLD  [L_SER20XX]  111.73,59.74 270 top
L12  SRR1280-150M  [L_SRR1280]  92.96,51.32 270 top
L14  CR75NP-220KC  [CR75]  62.52,70.78 270 top
L15  HI1812V101R-10  [L1812]  54.99,92.65 0 top
L16  HI1812V101R-10  [L1812]  44.43,92.65 180 top
L17  HI1206T500R-00  [1206]  70.98,77.21 180 top
Q2  FDC6330L  [SSOT-6]  92.3,76.25 180 top
Q3  SR3.3.TCT  [SOT-143]  106.51,74.57 270 top
Q4  7B-28.63636MAAJ-T  [7B]  113.01,33.9 0 top
Q5  FDC6330L  [SSOT-6]  69.85,20.83 270 top
Q7  SSM6P49NU,LFPZ  [MICRO_FET]  111.81,24.6 270 top
Q14  MAX9938HEUK  [SOT23-5]  65.93,39.47 0 top
Q15  SI4564DY  [SO-08]  59.81,41.16 270 top
Q16  CSD87331Q3D  [SON8_3.3X3.3_TI]  97,61.71 270 top
Q18  SI4564DY  [SO-08]  58.71,31.85 270 top
Q19  CSD87331Q3D  [SON8_3.3X3.3_TI]  92.06,42.04 0 top
Q20  IPD30N06S2L-23  [TO252]  37.24,41.17 180 top
Q21  IPD30N06S2L-23  [TO252]  40.85,23.16 90 top
Q23  FDN352AP  [SOT-23]  57.32,64.78 180 top
Q24  BSS138  [SOT23]  38.41,70.75 0 top
R1  300R  [0603]  133.6,44.32 90 top
R2  4x100K  [0603-ARRAY]  88.04,15.48 0 top
R3  1M  [0603]  95.21,77.01 270 top
R4  1M  [0603]  92.42,80.22 270 top
R5  1M  [0603]  90.53,72.47 90 top
R6  1M  [0603]  90.17,80.22 90 top
R7  100K  [0603]  140.05,41.53 0 top
R8  3.57K  [0603]  140.05,40.01 0 top
R9  1M  [0603]  106.38,77.27 180 top
R10  1M  [0603]  103.68,76.47 90 top
R11  1M  [0603]  100.84,74.3 0 top
R12  470K  [0603-0RTOP]  121.91,18.7 0 top
R13  0R  [0603-0RTOP]  121.91,16.9 180 top
R14  33K  [0603]  128.11,52.1 0 top
R15  0R  [0603-0RTOP]  79.85,17.4 90 top
R16  0  [R0603]  63.37,85.6 270 top
R18  649R  [0603]  69.6,18.29 0 top
R19  649R  [0603]  69.6,16.64 0 top
R20  4x100K  [0603-ARRAY]  73.79,21.08 270 top
R21  4x100K  [0603-ARRAY]  73.79,17.53 270 top
R23  10K  [0603]  128.51,91.4 270 top
R24  1M  [0603]  135.31,59.6 180 top
R25  10K  [0603]  135.15,64.31 270 top
R26  0.22R  [0603]  114.6,89.41 0 top
R27  649R  [0603]  77.85,20.7 0 top
R28  649R  [0603]  78.61,23.11 90 top
R29  4x100K  [0603-ARRAY]  81.41,21.21 0 top
R30  10K  [0603]  133.4,64.31 270 top
R31  10K  [0603]  29.49,48.13 0 top
R32  10K  [0603]  29.49,49.78 0 top
R33  10K  [0603]  20.73,49.91 180 top
R34  1K  [0603]  20.73,48.26 0 top
R35  10K  [0603]  29.49,46.48 0 top
R36  1K  [0603]  25.17,44.07 270 top
R37  300R  [0603]  119.76,49.78 0 top
R38  470R  [0603]  30.25,44.07 270 top
R39  470R  [0603]  22.63,44.2 270 top
R40  0.025R  [0805]  65.82,47.6 0 top
R41  0.025R  [0805]  65.82,45.53 0 top
R42  0.025R  [0805]  77.92,61.58 0 top
R43  0.025R  [0805]  77.92,63.8 0 top
R44  0.025R  [0805]  61.39,27.24 270 top
R45  470R  [0603]  57.85,23.31 180 top
R46  470R  [0603]  57.85,21.71 180 top
R151  470R  [0603]  139.16,90.29 90 top
R152  470R  [0603]  140.96,90.29 90 top
R154  0.025R  [0805]  65.81,43.48 0 top
R156  1M  [0603]  54.48,40.09 90 top
R157  10  [R0603]  74.9,59.19 90 top
R158  10  [R0603]  82.4,59.29 90 top
R159  1M  [0603]  59.79,36.96 180 top
R160  178k,1%  [R0603]  94.4,65.41 180 top
R161  0  [R0603]  92.2,63.08 180 top
R162  10K  [0603]  59.67,45.6 180 top
R163  0  [R0603]  92.2,60.98 180 top
R164  5.90K,1%  [0603]  81,51.29 180 top
R165  93.1K,1%  [0603]  83.3,54.19 180 top
R166  20.0k,1%  [R0603]  98.1,65.31 0 top
R167  100K  [0603]  77.56,50.04 270 top
R170  1M  [0603]  53.91,30.66 270 top
R171  10  [R0603]  79.86,42.74 90 top
R172  10  [R0603]  84.96,42.74 90 top
R173  1M  [0603]  58.41,28.25 0 top
R174  1M  [0603]  53.91,33.75 90 top
R175  3.3K  [0805]  29.03,38.89 90 top
R176  3.3K  [0805]  38.47,31.23 0 top
R177  178k,1%  [R0603]  95.76,33.04 90 top
R178  0  [R0603]  88.16,39.04 270 top
R179  10K  [0603]  54.81,36.85 0 top
R180  0  [R0603]  93.36,33.04 270 top
R181  5.90K,1%  [0603]  82.16,34.14 0 top
R182  93.1K,1%  [0603]  79.26,38.74 270 top
R183  1M  [0603]  43.05,45.34 0 top
R184  1M  [0603]  48.37,21.63 90 top
R185  20.0k,1%  [R0603]  82.06,32.04 0 top
R186  100K  [0603]  86.06,39.04 90 top
R187  47K  [0603]  50.01,40.45 180 top
R189  0.12R  [0805]  53.82,64.48 90 top
R190  47K  [0603]  50.11,35.75 0 top
R193  10K  [0603]  44.12,68.68 0 top
R194  3.09M  [0603]  48.62,64.68 90 top
R197  1M  [0603]  46.72,64.68 270 top
R198  10  [R0603]  70.06,93.57 90 top
R200  1M  [0603]  61.06,82.37 0 top
R201  1M  [0603]  61.06,80.17 0 top
R202  DNP  [R0603]  64.76,82.37 0 top
R203  DNP  [R0603]  64.76,80.17 0 top
R204  1K  [0603]  58.06,85.97 270 top
R205  100K  [0603]  60.06,85.97 270 top
R206  33R  [0603]  53.82,83.62 180 top
R207  3.3K  [0603]  38.53,81.74 180 top
R208  6.8k  [R0603]  38.53,79.64 0 top
R209  120k  [R0603]  35.69,77.04 270 top
R210  1M  [0603]  34.79,69.94 180 top
R211  3.9k  [R0603]  34.79,72.34 0 top
TP1  [SMD_ROUND_1MM]  116.81,44 0 top
TP2  [SMD_ROUND_1MM]  116.16,36.42 0 top
TP3  [SMD_ROUND_1MM]  130.11,46.5 0 top
TP4  [SMD_ROUND_1MM]  128.11,46.48 0 top
TP5  [SMD_ROUND_1MM]  126.65,46.48 0 top
TP6  [SMD_ROUND_1MM]  140.72,43.18 0 top
TP8  [SMD_ROUND_1MM]  113.1,26.33 180 top
TP9  [SMD_ROUND_07MM]  155.44,63.09 90 top
TP10  [SMD_ROUND_1MM]  139.7,20.32 0 top
TP11  [SMD_ROUND_07MM]  108.56,45.6 90 top
TP12  TP_0812  [TP_0.8_1.2]  106.66,45.6 0 top
TP60  [SMD_ROUND_07MM]  152.51,94.21 270 top
TP61  TPB1,27  [B1,27]  57.19,76.01 0 top
TP62  TPB1,27  [B1,27]  101.28,48.59 0 top
TP63  TPB1,27  [B1,27]  24.33,34.41 0 top
TP64  TPB1,27  [B1,27]  48.51,56.26 0 top
TP65  TPB1,27  [B1,27]  77.74,71.91 0 top
TP66  TPB1,27  [B1,27]  48.62,51.28 0 top
TP67  TPB1,27  [B1,27]  80.54,71.91 0 top
TP69  [P1-13@1]  57.76,81.57 0 top
U1  LTC1955  [LFCSP_5X5_032]  116.71,16.2 0 top
U2  LE33CD  [LE33]  54.19,52.64 270 top
U3  ADS1015IDGS  [MSOP10]  25.06,47.15 270 top
U6  TPS43061  [QFN16_3X3_EP]  78.6,54.89 180 top
U7  TPS43061  [QFN16_3X3_EP]  86.96,34.24 0 top
U8  TPA3111D1PWP  [TSSOP28_EP]  63.66,91.77 90 top
U9  OPA322SAIDBVT  [SOT23-6']  38.69,75.68 180 top
X1  FH12-22(10)SA-1SH  [CON-FPC-1.0MM-10POS]  104.47,6.64 0 top
X2  MINI-USB_4P-85-32004-10X  [85-32004-10X]  161.8,88.27 180 top

## Tracks (layer width: path | path; a pad name or v marks a point on that pad's centre or on a via)
3V3_AUD  (via drill 0.3)
  Top 0.203: U9.6 39.64,73.18 v39.67,73.15 | C181.1 55.85,88.12 v56.69,88.95 | R207.1 39.38,83.36 v39.59,83.57
  Top 0.762: C180.1 54.32,82.06 54.63,82.37 54.63,83.58 R206.1 C182.1 54.67,87.97 C181.1
  SUPPLY 0.203: v39.67,73.15 39.67,82.73 39.95,83.01 | 39.95,83.01 51.33,83.01 56.71,88.39 56.71,88.92 v56.69,88.95 | v39.59,83.57 39.59,83.36 39.95,83.01
5V_ON  (via drill 0.3)
  Top 0.152: IC3.92 130.01,28.78 129.02,29.77 v128.16,29.77
  Top 0.203: C163.1 44.91,70.25 45.77,69.39 IC21.1 49.37,69.39 v49.73,69.04
  SUPPLY 0.152: v128.16,29.77 127.76,29.77 127.54,30 127.06,30 126.78,29.72 115.84,29.72 109.16,36.4 109.16,37.92 v109.34,38.1 | v107.64,38.84 107.64,47.45 v107.78,47.59
  Bottom 0.152: v109.34,38.1 108.37,38.1 v107.64,38.84
  Bottom 0.203: v49.73,69.04 50.72,68.04 50.77,68.04 51.12,67.69 51.12,67.33 54.46,63.99 56.81,66.34 97.17,66.34 99.51,64.01 99.51,52.91 101.14,51.28 104.08,51.28 v107.78,47.59
18V_GND
  Top 0.305: U3.5 22.42,46.15 22.25,45.97 22.25,45.11 22.12,44.98
  Top 0.762: R39.1 22.12,44.98 C40.1 20.32,44.98 19.94,45.36 C39.2 R34.1
18V_SENSE
  Top 0.762: R33.2 18.06,49.91 17.14,50.83 17.14,54.13 15.39,55.88 J15.1A
  Top 2: J15.3A J15.3 | J15.1A J15.1
  Bottom 2: J15.3A 9.91,51.11 9.91,55.5 10.29,55.88 J15.1A
+3.3V  (via drill 0.3, 0.38, 0.51, 0.61)
  Top 0.152: IC3.86 127.61,26.02 128.47,25.17 C6.1 129.03,23.52 v129.66,23.52 | C9.1 119,35.4 v118.97,35.43 | R12.2 122.7,20.42 v123.13,20.85 | v86.11,18.67 86.23,18.54 86.23,16.51 86.36,16.38 R2.8 86.84,17.07 87.02,17.25 87.5,17.25 87.64,17.11 R2.7 | R15.2 79.15,18.19 78.99,18.03 v78.99,15.24 | C16.2 116.36,10.19 116.71,10.54 116.71,12.57 | U1.12 116.46,12.83 116.71,12.57 | v46.56,33.53 49.98,33.53 v50.89,34.44 | 116.71,12.57 116.96,12.82 U1.13
  Top 0.203: R186.2 86.06,40.98 86.4,41.33 v86.4,41.81 | C5.1 138.22,35.1 137.81,35.51 136.37,35.51 135.96,35.1 IC3.16 134.1,35.1 v133.67,34.67 | C1.1 137.93,27.73 v138.02,27.64 138.02,27.26 138.85,26.43 138.85,23.01 v139.11,22.76 | C8.1 128.3,42.61 v127.86,43.05 | C2.1 125.25,43.36 v125.95,44.07 | R1.2 133.6,46.13 v133.95,46.48
  Top 0.229: IC3.2 136.2,29.5 136.8,28.9 C1.1 | IC3.62 C9.1 | IC3.46 125.21,42.39 125.01,42.59 C2.1 | IC3.37 128.81,41.6 129.01,41.8 C8.1 | Q7.4 113.56,23.95 114.11,24.5 C29.2
  Top 0.254: R167.2 77.56,47.75 v78.07,47.24 | TP64.TP 48.54,56.26 48.54,53.82 v48.51,53.47 | J1.9 166.16,13.64 161.23,13.64 J8.10 | C16.2 114.33,10.19 v114.3,10.16 | v106.81,17.53 106.93,17.78 106.93,20.95
  Top 0.279: U1.1 113.14,17.95 112.9,18.19 C17.1
  Top 0.305: R190.2 v50.89,34.44
  Top 0.356: R14.2 128.9,50.47 J11.2 | D31.4 D31.5 49.65,38.05 49.93,37.77 49.93,36.91 50.18,36.65 50.74,36.65 50.89,36.5 R190.2 | v47.97,40.44 47.99,40.45 R187.2 | C17.1 112.87,19.23 v112.87,20.32 | v109.44,25.27 109.46,25.25 Q7.1 | C29.2 114.53,23.92 113.8,23.2 v113.16,23.2 | R37.2 120.55,47.68 v120.49,47.62 | J18.5 30.12,9.96 v30.12,4.55
  Top 0.406: TP9.P$1 155.44,61.49 v155.41,61.47
  Top 0.508: v113.25,21.74 113.23,21.82 108.55,21.82 107.69,20.95 106.93,20.95 v103.55,20.95 99.61,24.89 v97.92,24.89
  Top 0.61: U2.1 49.47,54.55 48.51,53.59 v48.51,53.47
  Top 0.762: v62.59,50.29 64.68,52.38 C157.1
  Top 1.016: 69.99,52.38 C157.1 | 69.99,52.38 D27.+ | v70.07,49.71 70.07,52.3 69.99,52.38
  SUPPLY 0.152: v118.97,35.43 118.97,37.34 120.36,38.73 120.36,39.62 119.6,40.39 119.09,40.39 117.95,41.53 117.95,42.8 118.33,43.18 118.33,45.47 v120.49,47.62 | v129.66,23.52 130.4,23.52 132.07,21.84 138.19,21.84 v139.11,22.76 139.11,22.67 | v113.25,21.74 113.76,21.74 113.93,21.92 114.89,21.92 114.99,21.82 v116.17,21.82 | v78.99,15.24 78.99,15.75 80.72,17.48 84.91,17.48 v86.11,18.67
  SUPPLY 0.203: v125.95,44.07 126.59,44.7 | v133.95,46.48 133.95,46.99 133.19,47.75 131.62,47.75 J11.2
  SUPPLY 0.254: v78.07,47.24 78.07,48.44 | v114.3,10.16 111.38,10.16 106.81,14.73 v106.81,17.53
  SUPPLY 0.305: v50.89,34.44 50.89,37.52 v47.97,40.44 | v139.11,22.76 154.38,22.76 157.89,19.25 157.89,13.31 158.78,12.41 J8.10
  SUPPLY 0.356: v112.87,20.32 113.25,20.7 v113.25,21.74 113.25,23.11 v113.16,23.2 111.09,25.27 v109.44,25.27 | v133.67,34.67 131.03,34.67 129.89,35.81 129.89,37.72 129.13,38.48 125.06,38.48 122.01,35.43 v118.97,35.43
  SUPPLY 0.406: v86.11,18.67 88.67,16.1 92.56,16.1 93.19,16.74 93.19,18.59 94.53,19.89 100.97,19.89 102.03,20.95 v103.55,20.95
  SUPPLY 0.508: v86.4,41.81 88.38,39.83 88.38,36.85 92.53,32.72 96.54,32.72 97.54,31.72 97.54,25.27 v97.92,24.89
  SUPPLY 0.61: v86.4,41.81 79.77,48.44 78.07,48.44 71.7,48.44 70.43,49.71 v70.07,49.71
  SUPPLY 0.762: v127.86,43.05 127.86,43.43 126.59,44.7 123.67,47.62 | v120.49,47.62 123.67,47.62 | 123.67,47.62 123.67,49.78 125.95,52.07 129.76,52.07 | 129.76,52.07 152.11,52.07 155.41,55.37 v155.41,61.47 | J11.2 129.77,52.06 129.76,52.07
  Bottom 0.152: v123.13,20.85 117.11,20.85 116.27,21.69 116.27,21.72 v116.17,21.82 | v30.12,4.55 31.17,5.28 32.69,5.28 43.41,16 45.29,16 46.51,17.22 46.51,31.56 46.33,31.74 46.33,33.28 v46.56,33.53
  Bottom 0.203: v133.67,34.67 133.67,33.95 133.97,33.65 133.97,32.9 133.7,32.62 133.7,30.72 133.82,30.59 133.82,29.72 135.93,29.72 v138.02,27.64
  Bottom 0.254: v123.13,20.85 123.89,21.61 125.15,21.61 126.67,20.09 129.26,20.09 131.24,22.07 131.24,22.55 130.28,23.52 v129.66,23.52
  Bottom 0.61: 49.66,47.5 47.88,45.72 47.88,40.53 v47.97,40.44 | 49.66,47.5 49.66,52.7 48.89,53.47 v48.51,53.47 | v62.59,50.29 62.59,50.24 59.84,47.5 49.66,47.5
+3.3V/1  (via drill 0.3)
  Top 0.152: Q7.6 113.1,25.43 TP8.P$1 | v87.34,23.88 88.82,22.4 93.44,22.4 97.28,26.24 99.81,26.24 101.72,24.33 104.73,24.33 106.69,26.29 v109.62,26.29 | v44.58,28.32 45.47,27.43 v48.61,27.43
  Top 0.203: C33.1 139.74,59.56 139.74,58.8 139.56,58.62 137.36,58.62 137.1,58.88 137.1,59.38 136.89,59.6 R24.1 136.1,60.89 136.06,60.94 134.05,60.94 132.68,59.56 131.46,59.56 131.3,59.4 C22.1 131.3,57.69 131.54,57.45 132.12,57.45 132.33,57.25 132.33,56.82 132.17,56.67 131.23,56.67 IC5.8 130.15,56.64 129.92,56.41 129.92,56.01 | Q7.P1 111.85,25.14 111.85,25.91 111.47,26.29 v109.62,26.29
  Top 0.254: IC5.7 129.92,56.01 v128.98,56.01 v128.97,56.01 | 136.06,60.94 136.87,61.75 136.87,64.52 136.3,65.08 135.17,65.08 R25.1
  Top 0.305: U3.8 26.29,47.15 25.9,47.53 C37.1 25.93,49.83
  Top 0.356: Q7.6 111.96,25.25 Q7.P1 | IC8.7 141.18,56.63 141.44,56.9 141.44,57.72 141.25,57.91 | 141.25,57.91 IC8.8 | C33.1 140.96,59.6 141.25,59.31 141.25,57.91 | IC8.3 133.51,55.37 132.88,56.01 IC5.7 | IC6.8 131.87,62.25 132.15,62.53 132.15,64.87 132.36,65.08 133.39,65.08 R30.1 R25.1 | R206.2 52.97,83.48 52.16,82.68 50.51,82.68 v49.75,81.92 | R201.1 59.8,79.76 v56.61,79.76 | v25.93,52.55 25.93,51.44 C48.1 25.9,51.37 C37.1
  Top 0.61: 30.35,49.91 30.28,49.84 R32.2 30.28,51.03 v30.25,51.05
  Top 0.762: R201.1 R200.1 60.06,82.52 R205.2 | R32.2 R31.2
  SUPPLY 0.254: v128.97,56.01 126.94,56.01 122.98,52.05 119.03,52.05 108.7,41.72 108.7,28.65 109.62,27.74 v109.62,26.29
  SUPPLY 0.356: J49.2 22.02,79.54 22.83,78.74 22.83,74.04 24.35,72.52 v30.57,72.52 36.16,72.52 36.92,71.75 40.1,71.75 40.73,72.39 40.73,75.95 46.7,81.92 v49.75,81.92 51.91,79.76 v56.61,79.76
  Bottom 0.152: v25.93,52.55 25.93,51.28 26.16,51.05 v30.25,51.05 30.53,51.33 33.53,51.33 40.92,43.94 40.92,43.46 41.12,43.26 41.2,43.18 41.2,42.79 44.47,39.51 44.47,29.06 44.58,28.96 v44.58,28.32
  Bottom 0.203: v87.34,23.88 84.8,23.88 83.66,25.02 70.58,25.02 68.17,27.43 v48.61,27.43 | v25.93,52.55 24.51,53.98 24.51,58.83 24.26,59.08 24.26,66.9 25.12,67.77 29.23,67.77 30.57,69.11 v30.57,72.52
+3.3V/2  (via drill 0.3, 0.35)
  Top 0.152: Q7.3 110.05,23.95 109.85,23.75 v109.85,23.44 | J2.2 144.98,30.92 142.79,28.73 v142.46,28.73 | v136.87,21.26 137.63,22.02 v137.63,23.37
  Top 0.203: IC2.8 108.79,73.27 108.6,73.08 108.6,72.52 | 108.6,72.52 108.6,71.5 108.75,71.35 109.67,71.35 C14.1 109.69,70.59 | R11.2 102.7,74.3 v102.71,74.3 | v108.04,72.52 108.6,72.52 | v112.57,8.84 112.57,8.03 113.49,7.11 113.49,2.31 112.62,1.45 100.66,1.45 v100.15,1.96 | v42.77,3.28 J18.10
  Top 0.254: v110.48,70.21 110.08,70.21 109.69,70.59 | C35.2 134.13,93.7 v132.63,92.2
  Top 0.305: Q7.3 111.66,23.95 Q7.P2
  Top 0.356: C35.2 134.93,97.97 J30.6
  SUPPLY 0.152: v136.87,21.26 135.81,20.19 115.8,20.19 115.59,19.99 114,19.99 113.66,19.65 113.66,19.59 112.11,18.03 v111.68,18.03
  SUPPLY 0.254: v109.85,23.44 108.3,24.99 108.3,41.88 122.5,56.08 122.5,66.8 118.81,70.48 | 118.81,70.48 110.76,70.48 v110.48,70.21 | 118.81,70.48 132.81,84.48 132.81,92.1 132.71,92.2 v132.63,92.2
  Bottom 0.152: v109.85,23.44 109.85,19.86 v111.68,18.03 111.84,17.86 | v142.46,28.73 140.48,26.75 140.48,26.52 137.63,23.67 v137.63,23.37
  Bottom 0.203: v102.71,74.3 102.71,73.03 103.27,72.47 104.95,72.47 105.28,72.14 107.66,72.14 v108.04,72.52 | 111.84,17.86 112.56,17.14 v112.56,8.85 v112.57,8.84 | v100.15,1.96 44.22,1.96 42.77,3.15 v42.77,3.28
  Bottom 0.254: JP1.2 146.28,30.99 J2.2
+5V  (via drill 0.3)
  Top 0.254: J18.4 27.53,25.78 v28.57,26.82 | v30.1,56.69 30.1,60.66 31.22,61.77 47.24,61.77 47.52,62.05 47.52,62.23 48.62,63.33 R194.1
  Top 0.61: C158.1 70.22,71.78 C156.1 70.15,71.91 70.15,73.41 70.6,73.86 72.79,73.86 73.35,74.42 76.67,74.42 77.74,73.36 TP65.TP
  Top 0.762: C149.1 55.61,58.82 56.85,57.58 C150.1 U2.8
  Top 1.016: C156.1 70.07,71.93 68.01,71.93 66.86,70.78 L14.2 | R194.1 C160.2
  Top 1.2: 68.63,62.78 D28.+ 69.98,62.95 69.98,63.37 70.22,63.62 C158.1 | C160.2 51.62,62.59 C149.1
  Top 1.27: 68.63,62.78 62.09,56.25 C150.1
  SUPPLY 0.254: v28.57,26.82 28.57,30.5 26.95,32.13 26.95,47.02 25.81,48.16 25.81,50.8 30.1,55.09 v30.1,56.69
+SMB  (via drill 0.3, 0.38, 0.51, 0.76, 1.2, 1.27)
  Top 0.152: R20.6 74.02,20.68 73.79,20.45 73.79,19.56 73.53,19.3 72.26,19.3 71.75,19.81 71.22,19.81 Q5.4
  Top 0.203: C154.1 53.24,69.78 52.85,69.39 IC21.8 51.07,69.39 50.77,69.09 50.77,68.33 51,68.09 IC21.6 53.03,68.09 53.24,67.88 C155.1
  Top 0.305: Q5.4 70.04,19.88 69.72,20.19 69.72,23.24 69.47,23.5 v69.22,23.5 | v130.89,86.87 130.84,86.91 C28.1 | v125.98,94.11 D2.A
  Top 0.356: C28.1 127.94,86.91 127.55,87.3 IC9.5 | J18.2 22.45,4.52 25.81,1.17 51.46,1.17 51.97,1.68 v51.97,10.9
  Top 0.457: C154.1 53.64,70.46 53.48,70.61 52.88,70.61 52.62,70.86 C153.1
  Top 0.508: C155.1 R189.2 | Q2.4 90.76,74.94 90.39,75.31 C11.1 v86.87,75.31 | 55.94,31.19 Q18.3 | v95.89,78.99 95.21,78.32 R3.1 | v121.54,94.49 121.93,94.1 122.17,94.1
  Top 0.61: C152.1 C153.1 | v50.19,42.04 50.32,41.91 | Q18.3 54.74,31.21 54.48,31.47 53.93,31.47 R170.1
  Top 0.762: R170.1 52.96,31.45 v52.07,32.33 | 51.77,41.91 51.64,42.04 v50.19,42.04
  Top 0.8: Q14.4 66.88,43.34 R154.2 R41.2 R40.2
  Top 1.016: R40.2 66.76,49.8 v67,49.81
  Top 1.2: C153.1 52.62,73.7 53.47,74.55 58.29,74.55 59.18,75.44 v61.98,75.44
  Top 1.27: Q15.3 56.12,40.53 55.75,40.89 54.53,40.89 R156.2
  Top 1.5: v52.58,48.64 53.95,47.26 C135.1 52.24,45.79 51.77,45.31 51.77,41.91 52.78,40.89 54.53,40.89
  Top 1.524: D2.A 122.17,94.1 121.16,93.09 121.16,92.34 C27.1
  SUPPLY 0.305: J1.10 166.59,16.71 165.58,16.71 164.03,18.26 164.03,49.28 160.07,53.24 | 132.21,74.4 v131.62,74.98 | J9.2 104.02,90.67 102.87,91.82 82.04,91.82 81.02,90.8 J7.2
  SUPPLY 0.356: 160.07,53.24 159.84,53.47 159.84,70.41 156.97,73.28 133.32,73.28 132.21,74.4
  SUPPLY 0.508: v86.87,75.31 90.55,78.99 v95.89,78.99 99.31,82.42 104.78,82.42 106.81,84.45 106.81,86.61 | 106.81,86.61 106.81,87 105.15,88.65 J9.2 | 106.81,86.61 114.68,94.49 v121.54,94.49
  SUPPLY 0.762: v52.07,32.33 54.05,34.31 | v50.19,42.04 51.03,41.2 51.51,41.2 54.05,38.66 54.05,34.31 | 54.05,34.31 59.49,28.88 v59.49,25.83
  SUPPLY 1.016: v61.98,75.44 62.1,75.31 v86.87,75.31
  SUPPLY 1.2: v61.98,75.44 58.76,78.65 51.7,78.65 50.98,79.38 47.12,79.38 41.91,74.17 41.91,62.23 51.94,52.45
  SUPPLY 1.5: v52.58,48.64 51.94,49.28 51.94,52.45
  SUPPLY 2: v67,49.81 67.06,49.86 67.06,52.15 67.08,52.38 62.48,52.38 62.31,52.45 51.94,52.45
  Bottom 0.305: v131.62,74.98 131.62,86.13 v130.89,86.87 129.29,86.87 127,89.15 127,93.09 v125.98,94.11
  Bottom 0.356: v51.97,10.9 60.91,19.84 64.57,23.5 v69.22,23.5
  Bottom 0.762: v59.49,25.83 59.51,25.81 59.51,21.11 60.78,19.84 60.91,19.84
+SMB_PRE
  Top 2: J15.9 J15.9A 14.67,27.88 17.35,30.56 F3.1
  SUPPLY 1.8: J45.4 49.79,25.84 47.3,23.34 47.3,14.99 45.54,13.23 24.46,13.23 15.54,4.32 9.2,4.32 6.96,6.55 6.96,24.86 J15.9
/3.3V1_ON  (via drill 0.3)
  Top 0.152: IC3.95 131.21,25.18 v130.45,24.41 | Q7.2 109.53,24.6 109.26,24.33 109.26,23.19 109.75,22.71 112.74,22.71 112.84,22.61 113.5,22.61 113.69,22.8 113.97,22.8 114.16,22.99 v118.23,22.99
  Bottom 0.152: v130.45,24.41 130.14,24.1 129.04,24.1 128.68,23.75 121.63,23.75 121.38,23.5 121,23.5 121,23.49 119.59,23.49 119.11,23.02 118.26,23.02 v118.23,22.99
/3.3V2_ON  (via drill 0.3)
  Top 0.152: IC3.94 130.81,25.28 130.52,24.99 130.21,24.99 129.86,24.64 129.86,24.13 129.88,24.1 129.9,24.1 130.3,23.7 130.3,23.05 129.87,22.61 129.87,21.69 129,20.83 v126.84,20.83 | Q7.5 113.47,24.6 113.63,24.77 113.63,25.27 113.89,25.53 115.03,25.53 115.92,26.42 116.55,26.42 117.44,25.53 117.44,23.6 v117.47,23.57
  Bottom 0.152: v126.84,20.83 125.57,22.1 118.2,22.1 117.44,22.86 117.44,23.55 v117.47,23.57
/CL_CS1
  Top 0.152: IC3.1 136.09,29.1 136.49,28.7 136.49,28.32 138.52,26.29 138.52,21.5 TP10.P$1
/CL_CS2  (via drill 0.3)
  Top 0.152: IC3.17 133.13,35.5 v133.06,35.43 | v134.59,16.76 134.59,17.29 136.29,18.99 136.29,21.5 136.87,22.08 v136.87,22.86 | v134.59,14.22 140.41,14.22 142.75,16.56 144.65,16.56 v144.93,16.84
  Bottom 0.152: v133.06,35.43 133.06,34.1 133.64,33.52 133.64,33.03 133.37,32.76 133.37,30.58 133.5,30.45 133.5,25.27 135.07,23.7 136.04,23.7 v136.87,22.86 | v134.59,16.76 v134.59,14.22 | v144.93,16.84 145.26,17.17 154.94,17.17 155.93,16.18 155.93,9.17 159.03,6.07 163.68,6.07 165.35,4.39 170.16,4.39 170.71,4.95 170.71,12.6 169.98,13.34 167.86,13.34 J1.7
/CTS
  Top 0.152: IC18.11 145.73,94.11 145.34,94.5 J41.2
/FMEM1_CS  (via drill 0.3)
  Top 0.152: R24.2 133.46,59.6 133.24,59.38 133.24,58.12 133.45,57.91 IC8.1
  Top 0.203: IC3.28 132.41,39.61 132.83,39.19 133.52,39.19 133.72,39.4 133.72,40.63 v133.99,40.89 | IC8.1 136.98,57.91 137.81,57.07 137.81,53.26 138.8,52.27 138.8,47.36 v137.16,45.72
  SUPPLY 0.203: v133.99,40.89 133.99,42.93 136.78,45.72 v137.16,45.72
/MCLR  (via drill 0.3)
  Top 0.152: J11.1 127.23,52.01 R14.1 | v131.79,33.88 131.81,33.9 IC3.13 | IC4.4 83.19,14.99 82.93,14.73 v82.3,14.73
  Bottom 0.152: J11.1 127.23,46.47 125.01,44.25 123.44,44.25 122.98,43.79 122.98,42.9 124.84,41.04 124.84,36.55 | v131.79,33.88 127.5,33.88 124.84,36.55 | v82.3,14.73 83.38,14.73 84.27,15.62 89.08,15.62 89.15,15.54 90.3,15.54 91.06,16.31 101.02,16.31 102.75,18.03 105.82,18.03 106.62,18.84 106.62,21.71 106.35,21.98 106.35,22.83 108.28,24.76 108.28,26.41 109.04,27.18 109.73,27.18 | 109.73,27.18 | 109.73,27.18 109.99,27.18 111.43,25.73 113.54,25.73 114.17,26.37 114.17,26.89 114.52,27.23 114.71,27.23 115.51,28.03 115.51,33.83 116.22,34.54 119.89,34.54 121.89,36.55 124.84,36.55
/MCLR2  (via drill 0.3)
  Top 0.152: IC4.6 85.09,14.86 v85.22,14.73
  Bottom 0.152: v85.22,14.73 86.03,13.92 86.35,13.92 86.75,13.51 92.45,13.51 92.72,13.79 93.2,13.79 93.79,13.21 100.49,13.21 J12.1
/RAM_CS  (via drill 0.3)
  Top 0.152: IC3.3 134.96,29.85 134.12,29.85 133.98,29.71 133.98,28.89 134.12,28.75 135.43,28.75 136.11,28.07 136.31,28.07 138.22,26.16 138.22,19.38 v137.89,19.05 | J8.13 161.28,16.23 159.51,16.23 157.94,17.8 154.76,17.8 154.31,17.35 v154.31,16.56
  Bottom 0.152: v137.89,19.05 137.94,19 137.94,18.17 138.91,17.2 138.91,15.77 139.34,15.34 143.44,15.34 144.35,16.26 152.25,16.26 152.55,16.56 v154.31,16.56
/RTS
  Top 0.152: IC18.3 150.93,92.49 151.43,92.99 152.42,92.99 155.5,96.08 J41.6
/SM_FAULT  (via drill 0.3)
  Top 0.152: IC3.21 138.67,37.1 v139.29,37.72 | U1.24 120.03,17.95 120.24,18.16 120.24,18.8 120.11,18.92 v119.6,18.92
  SUPPLY 0.152: v139.29,37.72 142.72,37.72 143.86,36.58 143.86,26.24 141.65,24.03 134.77,24.03 133.44,25.35 131.99,25.35 131.63,24.99 130.21,24.99 126.62,21.41 126.6,21.41 126.27,21.08 125.19,21.08 v124.94,20.83
  Bottom 0.152: v124.94,20.83 123.03,18.92 v119.6,18.92
/XB_RESET
  Top 0.152: IC3.18 136.68,35.9 136.78,35.99 141.08,35.99 141.15,35.92 141.63,35.92 141.98,36.26 141.98,36.7 146.21,40.94 J2.6
  Bottom 0.254: JP1.7 148.08,42.29 147.42,42.29 J2.6
A1
  Top 0.152: L2.2 100.57,80.67 101.06,81.15 102.33,81.15 102.75,81.57 J9.3 102.75,89.62 101.82,90.55 80.61,90.55 79.75,89.69 J7.3
A+  (via drill 0.3)
  Top 0.203: Q3.3 107.55,72.92 107.28,72.64 100.8,72.64 100.06,73.39 R11.1 100.04,74.32 100.04,75.18 100.57,75.71 L2.1 v102.2,76.58 | IC2.6 108.69,75.81 108.42,76.07 108.42,76.83 107.99,77.27 R9.1 107.28,77.39 v107.28,78.49
  Bottom 0.203: v102.2,76.58 104.11,78.49 v107.28,78.49
ACT_S1_B  (via drill 0.3)
  Top 0.152: IC3.52 119.3,38.3 v118.56,39.04 | v46.48,43.69 42.98,43.69 42.39,44.27 42.39,45.21 R183.1
  Top 1.524: R183.1 41.64,45.97 Q20.1
  Bottom 0.152: 93.26,22.94 93.24,22.96 88.9,22.96 88.65,23.22 84.48,23.22 83.59,24.11 77.14,24.11 76.61,24.64 70.94,24.64 70.89,24.69 70.44,24.69 68.23,26.9 53.55,26.9 53.46,26.98 48.98,26.98 48.85,26.85 48.37,26.85 48.03,27.19 48.03,27.59 47.93,27.69 47.93,28.08 47.17,28.84 47.17,31.33 46.64,31.86 46.64,32.45 47.16,32.97 47.16,43.01 v46.48,43.69
  Bottom 0.203: v118.56,39.04 117.77,39.04 116.93,39.88 107.41,39.88 106.01,38.48 106.01,35.69 93.26,22.94
ACT_S2_B  (via drill 0.3)
  Top 0.152: IC3.53 118.53,37.9 117.44,38.99 117.44,40.26 116.68,41.02 v116.05,41.02 | R184.1 48.37,17.31 49.53,16.15 63.91,16.15 65.08,17.32 65.08,23.24 67.69,25.86 72.01,25.86 72.64,26.49 72.64,28.46 72.52,28.59 72.52,29.32 73.04,29.84 74.52,29.84 75.74,31.06 77.3,31.06 77.64,30.72 77.64,29.8 78.31,29.13 81.93,29.13 83.07,27.99 v85.24,27.99
  Top 0.61: Q21.1 45.69,20.84 R184.1
  Bottom 0.152: v116.05,41.02 106.65,41.02 105,39.37 105,35.81 100.93,31.75 99.85,31.75 99.65,31.55 98.16,31.55 97.63,32.08 97.2,32.08 96.69,31.57 95.33,31.57 94.99,31.23 94.99,30.75 95.22,30.52 95.22,26.04 92.45,23.27 89.03,23.27 86.39,25.91 86.39,27.09 85.84,27.63 85.6,27.63 v85.24,27.99
AGND  (via drill 0.3, 0.61)
  Top 0.152: U8.EP 62.09,91.77 v61.99,91.67
  Top 0.203: 68.12,80.14 68.34,80.37 v68.34,80.39 | C172.2 v65.06,83.82 v65.07,83.82 | U8.24 62.04,92.16 62.05,92.15 62.43,92.15 | 62.43,92.15 63.28,92.15 U8.EP | U8.19 65.29,92.19 65.25,92.15 64.04,92.15 U8.EP | U8.8 63.99,91.44 U8.EP | U8.4 61.39,91.11 61.78,91.5 | 61.78,91.5 62.43,92.15 | U8.3 60.74,91.38 61.23,91.87 61.41,91.87 61.78,91.5 | U9.2 38.69,75.88 38.14,75.34 v36.85,75.31 | R210.2 33.92,69.93 v32.66,69.93 | R211.2 35.63,72.33 v35.63,71.14 | C180.2 52,80.92 v53.43,82.35 | Q24.2 v39.36,68.05
  Top 0.508: C171.2 68.32,80.34 68.12,80.14 65.65,80.14 R203.2 R202.2 | L17.2 v69.51,78.94 v69.51,79.78 | C167.2 v68.16,99.62 v68.17,99.62 | C168.2 v57.66,99.91 v57.68,99.92
  Top 0.762: C179.2 C176.2 50.94,90.55 v51.38,90.12 51.72,89.78 C181.2 51.72,86.8 51.23,86.32 C177.1 51.33,85.62 C182.2 | C168.2 59.4,98.46 C169.2 | C167.2 70,98.16 C170.2
  Top 1.2: J17.1 6.48,99.19 5.71,98.42 v5.71,98.3 v5.71,94.11 | v5.71,86.49 v5.71,82.04 5.71,78.87 | v5.71,94.11 v5.71,90.68 v5.71,86.49 | 5.71,78.87 v5.71,72.77 5.71,72.14 6.6,71.25 J17.12 | J17.9 v5.84,78.87 5.71,78.87 | J17.6 v5.71,86.49 | J17.3 v5.71,94.11
  DGND 0.508: v69.51,78.94 v69.51,79.78
  other vias: 64.2,91.67 62.83,91.69 65.14,91.69 49.8,91.67 40.99,81.41 40.99,84.58 40.99,86.49 40.99,79.5
  pour DGND (isolate 0.305, rank 2): 1.11,102.1 70.78,102.1 70.78,75.44 67.02,75.44 67.02,78.74 51.02,78.74 51.02,75.44 41.11,75.44 41.11,67.04 1.11,67.04
  pour Top: 41.39,77.12 44.89,77.12 45.59,77.82 45.59,87.32 45.09,87.82 41.29,87.82 40.69,87.22 40.69,77.82
AUD_AMP_FAULT#
  Top 0.203: 60.09,87.83 U8.2 | 60.09,87.83 60.09,86.84 R205.1 R204.1 | U8.1 59.44,87.95 59.55,87.83 60.09,87.83
AUD_AMP_G0  (via drill 0.3)
  Top 0.152: v127.14,73.41 127.14,72.57 126.59,72.01 126.59,68.71 128.19,67.11 128.19,65.79 126.69,64.29 126.36,64.29 125.57,63.5 125.57,59.84 123.26,57.53 123.26,55.58 123.39,55.45 124.08,55.45 124.71,54.82 124.71,49.89 TP4.P$1 127.64,46.02 127.21,46.02 126.8,45.6 126.8,44.48 126.84,44.44 126.84,43.7 126.8,43.66 126.8,41.91 127.21,41.49 IC3.41 | R200.2 61.92,82.36 61.92,81.66 61.66,81.41 61.26,81.41 61.05,81.2 61.05,79.35 61.56,78.84 67.51,78.84 67.81,78.54 67.81,76.05 68.29,75.56 72.87,75.56 73.25,75.18 77.82,75.18 79.22,73.79 81.12,73.79 82.26,72.64 82.26,71.5 83.41,70.36 92.14,70.36 v93.95,72.16
  Top 0.203: U8.5 62.04,82.5 R200.2 R202.1
  Bottom 0.152: v127.14,73.41 126.86,73.12 126.86,73.11 126.52,72.77 126.04,72.77 125.66,73.15 110,73.15 108.35,71.5 105.02,71.5 104.69,71.83 101.24,71.83 101.01,72.06 94.05,72.06 v93.95,72.16
AUD_AMP_G1  (via drill 0.3)
  Top 0.152: R203.1 63.91,79.36 64.13,79.15 67.84,79.15 68.12,78.87 68.12,76.17 68.42,75.87 73.07,75.87 73.45,75.49 77.94,75.49 79.34,74.09 81.25,74.09 82.61,72.73 82.61,71.59 83.53,70.66 91.63,70.66 93.71,72.74 93.97,72.74 93.97,72.75 v94.58,72.75 | v126.28,73.36 126.28,68.58 127.88,66.98 127.88,65.91 126.56,64.59 126.23,64.59 125.27,63.63 125.27,59.97 122.95,57.66 122.95,55.42 123.24,55.14 123.96,55.14 124.3,54.8 124.3,48.83 TP5.P$1 126.49,46.33 126.49,44.35 126.53,44.31 126.53,43.83 126.49,43.79 126.49,41.78 126.81,41.46 IC3.42
  Top 0.203: U8.6 62.69,88.02 62.39,87.72 62.39,83.98 v62.88,83.49 | v62.91,81.25 62.27,81.25 61.97,80.95 61.97,80.22 R201.2 R203.1
  Bottom 0.152: v126.28,73.36 126.18,73.46 109.87,73.46 108.22,71.81 105.15,71.81 104.82,72.14 101.36,72.14 101.14,72.36 94.96,72.36 v94.58,72.75
  Bottom 0.203: v62.88,83.49 62.88,81.28 v62.91,81.25
AUD_AMP_INN  (via drill 0.3)
  Top 0.203: U8.11 65.94,87.64 v65.91,87.61 | v50.08,83.82 C177.2
  Bottom 0.203: v65.91,87.61 53.87,87.61 v50.08,83.82
AUD_AMP_INP  (via drill 0.3)
  Top 0.203: U8.12 66.59,87.09 v66.21,86.72 | v31.84,78.51 31.79,78.57 C175.2
  Top 0.508: C175.2 C174.2
  SUPPLY 0.203: v66.21,86.72 56.76,86.72 52.65,82.6 45.41,82.6 40.27,77.47 40.27,72.9 39.92,72.55 39.42,72.55 39.06,72.9 39.06,74.85 37.3,76.61 36.29,76.61 34.38,78.51 v31.84,78.51
AUD_AMP_SD#
  Top 0.965: R204.2 58.06,83.65 57.76,83.35 TP69.1
AUD_BSN
  Top 0.203: U8.22 63.34,96.47 62.91,96.89 C178.1 62.96,98.61 62.96,99.34 62.76,99.54 60.57,99.54 60.32,99.29 60.32,97.87 60.74,97.45 U8.26
AUD_BSP
  Top 0.203: U8.17 66.59,98.43 C173.1 66.46,98.59 66.46,99.39 66.24,99.62 64.08,99.62 63.85,99.39 63.85,97.66 63.99,97.52 U8.21
AUD_GVDD
  Top 0.203: 65.29,87.78 U8.10 | 65.29,87.78 65.29,87.39 65.06,87.17 C172.1 | U8.9 64.64,87.88 64.74,87.78 65.29,87.78
B1
  Top 0.152: L1.2 97.65,80.79 98.39,81.53 100.93,81.53 101.48,82.08 J9.4
  Bottom 0.152: J9.4 99.07,91.06 80.1,91.06 78.48,89.43 J7.4
B12_BOOT  (via drill 0.3)
  Top 0.203: v75.02,50.32 75.02,49.37 C126.1 | U6.11 75.38,54.63 75.38,54.67 75.05,54.99 75.05,56.26 v74.8,56.52
  SUPPLY 0.203: v74.8,56.52 74.8,50.55 v75.02,50.32
B12_COMP  (via drill 0.3)
  Top 0.203: R164.2 80.15,52.19 80.99,53.03 v81.53,53.03 | v81.27,56.44 81.27,56.08 81.14,55.95 81.14,55.37 80.92,55.14 U6.3
  Top 0.508: C131.1 R164.2
  Bottom 0.254: v81.27,56.44 81.53,56.19 v81.53,53.03
B12_FB  (via drill 0.3)
  Top 0.203: U6.4 80.63,55.64 80.76,55.78 80.76,56.09 80.67,56.19 80.67,56.69 81.02,57.05 82.72,57.05 83.33,57.66 v83.94,57.66 | v95.19,64.01 95.25,64.07 R160.1
  Top 0.508: R166.2 98.95,66.04 98.7,66.29 95.52,66.29 95.39,66.17 95.39,65.55 R160.1
  Bottom 0.203: v83.94,57.66 88.36,62.08 88.36,63.17 88.87,63.68 90.01,63.68 90.34,64.01 v95.19,64.01
B12_FEED
  Top 0.508: 80.88,60.69 81.4,60.17 82.37,60.17 R158.2
  Top 0.762: L11.2 103.42,56.83 102.08,58.17 87.93,58.17 85.95,60.14 R158.2
  Top 0.8: R43.2 R42.2 79.89,61.58 81.34,60.14 R158.2
B12_HDRV  (via drill 0.3)
  Top 0.203: U6.13 77.85,52.71 v77.54,52.4 | v89.2,63.02 89.26,63.08 R161.2
  SUPPLY 0.203: v77.54,52.4 85.03,52.4 85.56,52.93 85.56,59.38 v89.2,63.02
B12_HG
  Top 0.356: Q16.3 94.67,61.38 93.95,62.1 93.31,62.1 93.05,62.36 R161.1
B12_ISNS+
  Top 0.254: U6.6 78.85,56.95 79.02,57.12 79.02,57.62 C124.1
  Top 0.508: R157.1 78.2,58.34 C124.1
B12_ISNS-
  Top 0.254: U6.5 79.35,56.84 79.91,57.4 79.91,58.35 C124.2
  Top 0.508: C124.2 82.35,58.39 R158.1
B12_L
  Top 0.406: 100.86,62.68 Q16.8 | 100.86,62.68 103.27,65.09 | 100.21,62.03 Q16.7 | 100.21,62.03 100.86,62.68 | Q16.6 99.56,61.38 100.21,62.03
  Top 1.27: D20.A 102.82,68.01 103.27,67.56 103.27,65.09 L11.1
  pour Top: 99.33,61.39 99.36,61.37 102.96,61.37 104.34,62.48 105.91,62.48 106.43,63 106.43,67.12 105.78,67.77 104.72,67.77 103.52,68.96 100.45,68.96 99.71,69.7 97.35,69.7 97.05,69.39 97.05,67.84 100.04,67.84 100.02,66.32 100.02,64.49 99.74,64.21 99.33,63.8
B12_LDRV  (via drill 0.3)
  Top 0.203: U6.8 77.85,56.87 77.69,57.02 76.93,57.02 v76.8,56.9 | v90.14,60.96 90.16,60.98 R163.2
  SUPPLY 0.203: v76.8,56.9 80.87,56.9 81.02,57.05 81.91,57.05 88.49,63.63 89.88,63.63 90.14,63.37 v90.14,60.96
B12_LG
  Top 0.356: R163.1 93.05,59.95 93.39,59.61 99.46,59.61 99.66,59.82 99.66,60.45 99.38,60.73 Q16.5
B12_PG  (via drill 0.3)